# EAGLE schematic DrumidySynth (EAGLE 9.6.2)

## Sheet 1 of 6: F407
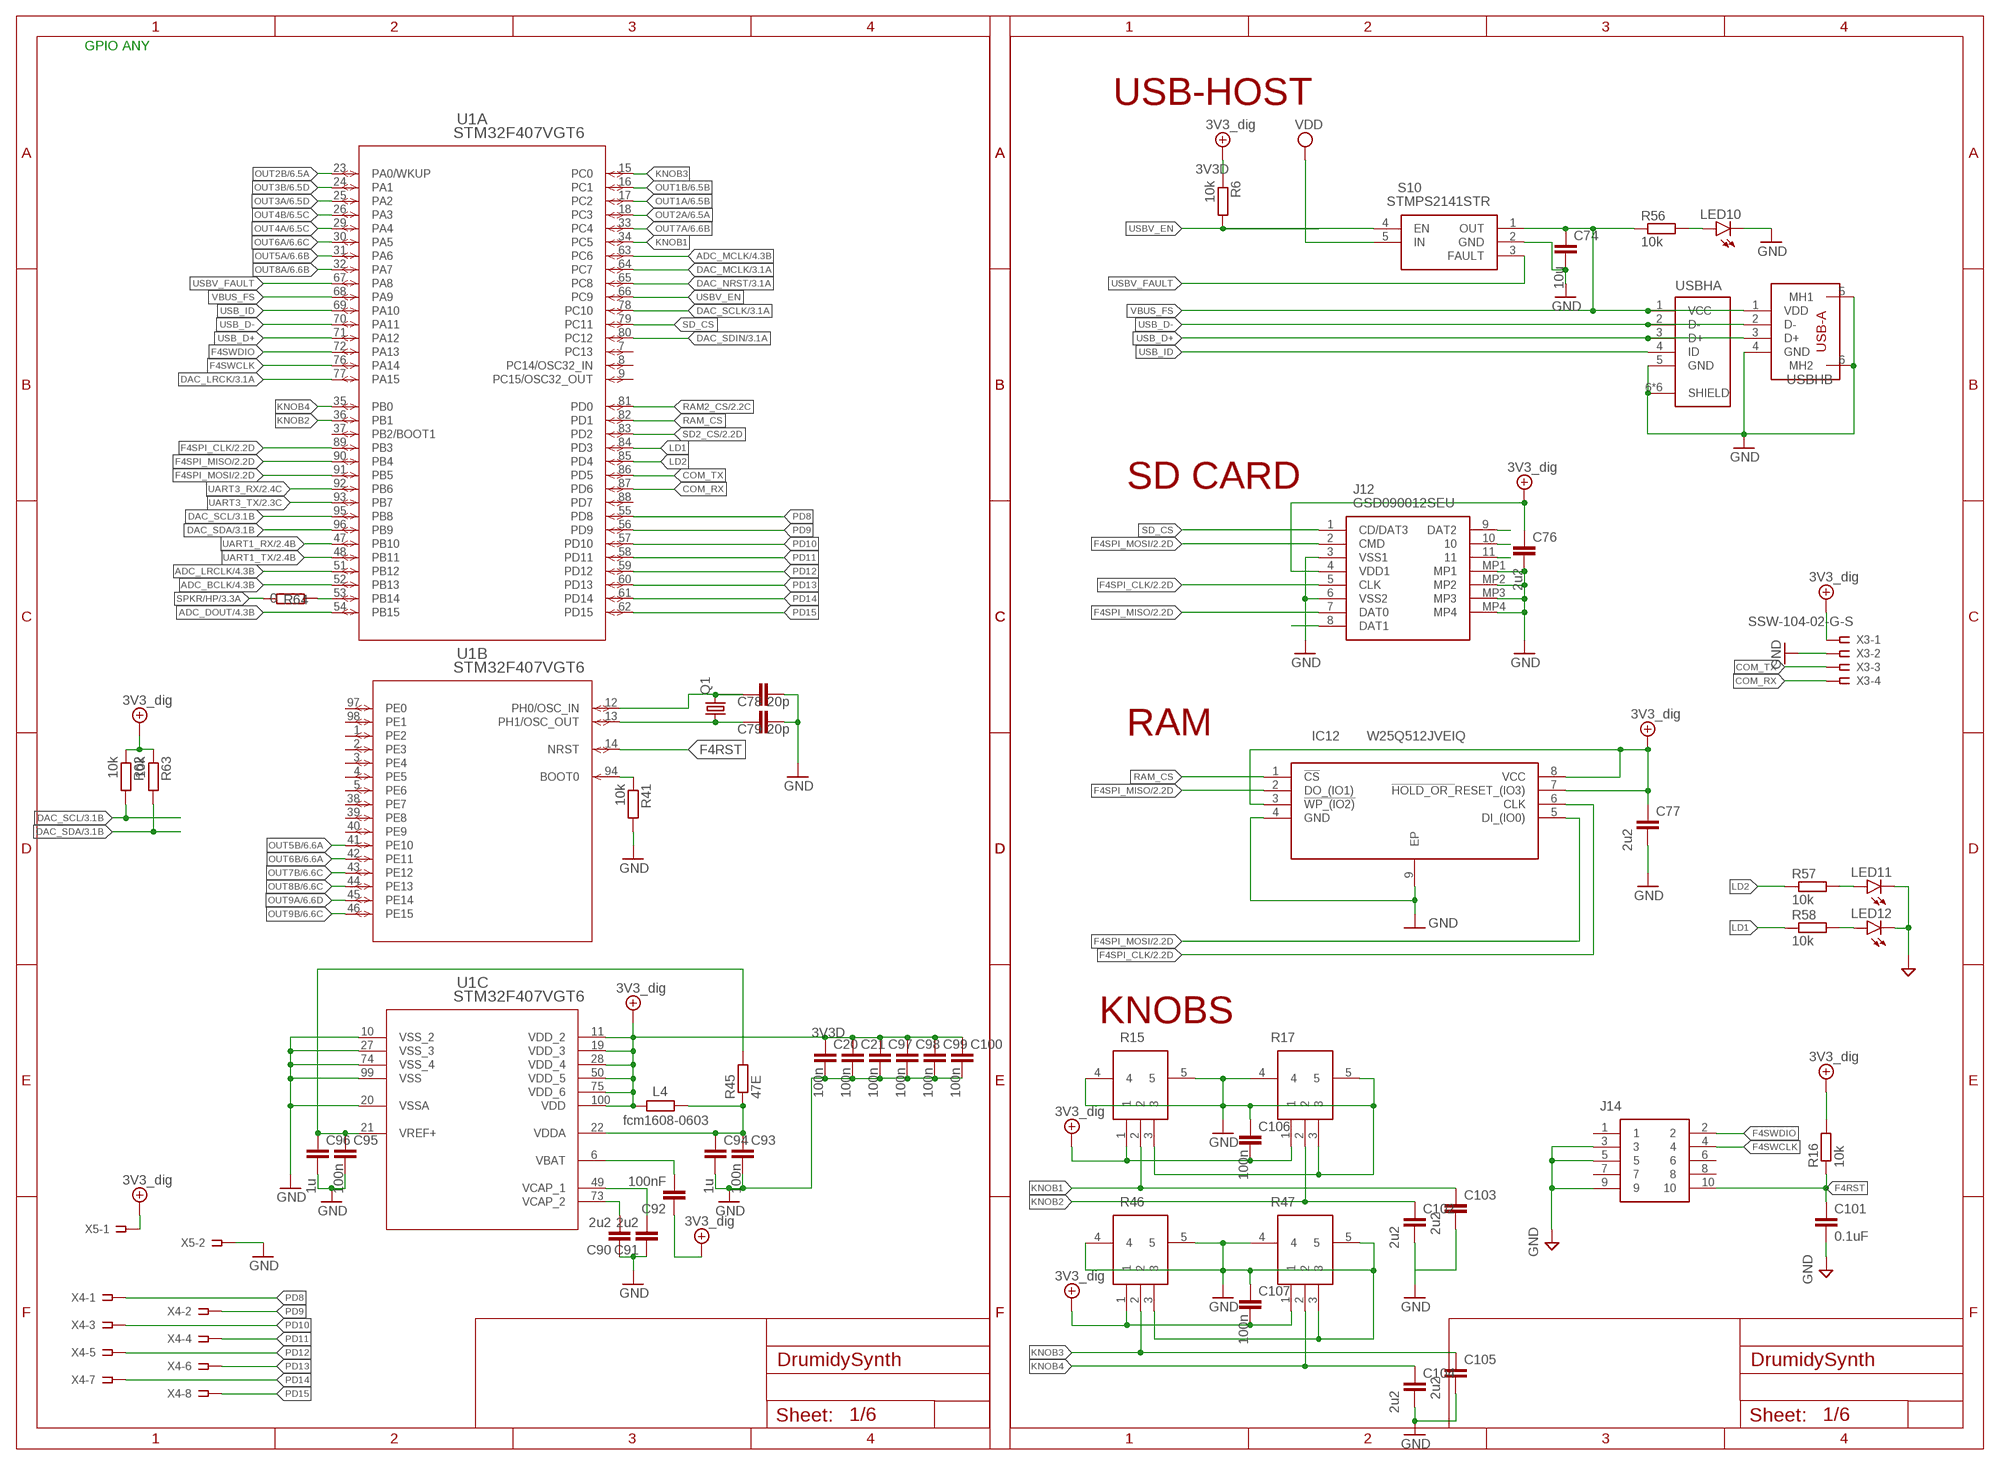
[diagram p0: schematic, sheet 1]

### Parts
C20  100n  C-EUC0603K  [C0603K]
C21  100n  C-EUC0603K  [C0603K]
C74  10u  C-EUC0805K  [C0805K]
C76  2u2  C-EUC0805K  [C0805K]
C77  2u2  C-EUC0805K  [C0805K]
C78  20p  C-EUC0402K  [C0402K]
C79  20p  C-EUC0402K  [C0402K]
C90  2u2  C-EUC0603K  [C0603K]
C91  2u2  C-EUC0603K  [C0603K]
C92  100nF  C-EUC0603K  [C0603K]
C93  100n  C-EUC0603K  [C0603K]
C94  1u  C-EUC0805K  [C0805K]
C95  100n  C-EUC0603K  [C0603K]
C96  1u  C-EUC0805K  [C0805K]
C97  100n  C-EUC0603K  [C0603K]
C98  100n  C-EUC0603K  [C0603K]
C99  100n  C-EUC0603K  [C0603K]
C100  100n  C-EUC0603K  [C0603K]
C101  0.1uF  C-EUC0402  [C0402]
C102  2u2  C-EUC0805K  [C0805K]
C103  2u2  C-EUC0805K  [C0805K]
C104  2u2  C-EUC0805K  [C0805K]
C105  2u2  C-EUC0805K  [C0805K]
C106  100n  C-EUC0603K  [C0603K]
C107  100n  C-EUC0603K  [C0603K]
IC12  W25Q512JVEIQ  [SON127P800X600X80-9N]
J12  GSD090012SEU  [GSD090012SEU]
J14  FTSH-105-01-F-DV-K-A-P-TR  [FTSH-105-XX-YYY-DV-K-A-P-TR]
L4  fcm1608-0603  R-EU_R0603  [R0603]
LED10  LEDCHIP-LED0603  [CHIP-LED0603]
LED11  LEDCHIP-LED0603  [CHIP-LED0603]
LED12  LEDCHIP-LED0603  [CHIP-LED0603]
Q1  CRYSTALHC49S  [HC49/S]
R6  10k  R-EU_R0603  [R0603]
R15  PTV09A-4025U-B103  [PTV09A4020FB103]
R16  10k  R-EU_R0603  [R0603]
R17  PTV09A-4025U-B103  [PTV09A4020FB103]
R41  10k  R-EU_R0603  [R0603]
R45  47E  R-EU_R0603  [R0603]
R46  PTV09A-4025U-B103  [PTV09A4020FB103]
R47  PTV09A-4025U-B103  [PTV09A4020FB103]
R56  10k  R-EU_R0603  [R0603]
R57  10k  R-EU_R0603  [R0603]
R58  10k  R-EU_R0603  [R0603]
R62  10k  R-EU_R0603  [R0603]
R63  10k  R-EU_R0603  [R0603]
R64  0  R-EU_R0603  [R0603]
S10  STMPS2141STR  [SOT95P280X145-5N]
U1  STM32F407VGT6  [LQFP100-14X14MM]
USBHA  10103594-0001LF  [AMPHENOL_10103594-0001LF]
USBHB  USB-A(292303-7)  [2923037]
X3  SSW-104-02-G-S  [SSW-104-02-G-S]
X4  SSW-104-02-G-D  [SSW-104-02-G-D]
X5  SSW-102-02-G-S  [SSW-102-02-G-S]

### Nets
3V3D: C20.1 C21.1 C76.1 C77.1 C92.1 C97.1 C98.1 C99.1 C100.1 C106.2 C107.2 IC12.3(!WP_(IO2)) IC12.7(!HOLD_OR_!RESET_(IO3)) IC12.8(VCC) J12.4(VDD1) L4.2 R6.1 R15.1 R16.2 R17.1 R46.1 R47.1 R62.1 R63.1 U1.11(C:VDD_2) U1.19(C:VDD_3) U1.28(C:VDD_4) U1.50(C:VDD_5) U1.75(C:VDD_6) U1.100(C:VDD) X3.1 X5.1 ; supply symbol labelled 3V3_dig ; also sheet 2,3,4,5,6
ADC_BCLK: U1.52(A:PB13) ; also sheet 4
ADC_DOUT: U1.54(A:PB15) ; also sheet 4
ADC_LRCLK: U1.51(A:PB12) ; also sheet 4
ADC_MCLK: U1.63(A:PC6) ; also sheet 4
COM_RX: U1.87(A:PD6) X3.4
COM_TX: U1.86(A:PD5) X3.3
DAC_LRCK: U1.77(A:PA15) ; also sheet 3
DAC_MCLK: U1.64(A:PC7) ; also sheet 3
DAC_NRST: U1.65(A:PC8) ; also sheet 3
DAC_SCL: R62.2 U1.95(A:PB8) ; also sheet 3
DAC_SCLK: U1.78(A:PC10) ; also sheet 3
DAC_SDA: R63.2 U1.96(A:PB9) ; also sheet 3
DAC_SDIN: U1.80(A:PC12) ; also sheet 3
F4RST: C101.1 J14.10 R16.1 U1.14(B:NRST)
F4SPI_CLK: IC12.6(CLK) J12.5(CLK) U1.89(A:PB3) ; also sheet 2
F4SPI_MISO: IC12.2(DO_(IO1)) J12.7(DAT0) U1.90(A:PB4) ; also sheet 2
F4SPI_MOSI: IC12.5(DI_(IO0)) J12.2(CMD) U1.91(A:PB5) ; also sheet 2
F4SWCLK: J14.4 U1.76(A:PA14)
F4SWDIO: J14.2 U1.72(A:PA13)
GND: C20.2 C21.2 C74.2 C76.2 C77.2 C78.2 C79.2 C90.1 C91.1 C93.2 C94.2 C95.2 C96.2 C97.2 C98.2 C99.2 C100.2 C101.2 C102.2 C103.2 C104.2 C105.2 C106.1 C107.1 IC12.4(GND) IC12.9(EP) J12.3(VSS1) J12.6(VSS2) J12.MP1 J12.MP2 J12.MP3 J12.MP4 J14.3 J14.5 J14.9 LED10.C LED11.C LED12.C R15.3 R15.4 R15.5 R17.3 R17.4 R17.5 R41.2 R46.3 R46.4 R46.5 R47.3 R47.4 R47.5 S10.2(GND) U1.10(C:VSS_2) U1.20(C:VSSA) U1.27(C:VSS_3) U1.74(C:VSS_4) U1.99(C:VSS) USBHA.5(GND) USBHA.6(SHIELD) USBHA.7(SHIELD) USBHA.8(SHIELD) USBHA.9(SHIELD) USBHA.S1(SHIELD) USBHA.S2(SHIELD) USBHB.4(GND) USBHB.5(MH1) USBHB.6(MH2) X3.2 X5.2 ; also sheet 2,3,4,5,6
KNOB1: C103.1 R15.2 U1.34(A:PC5)
KNOB2: C102.1 R17.2 U1.36(A:PB1)
KNOB3: C105.1 R46.2 U1.15(A:PC0)
KNOB4: C104.1 R47.2 U1.35(A:PB0)
LD1: R58.1 U1.84(A:PD3)
LD2: R57.1 U1.85(A:PD4)
N$16: R64.2 U1.53(A:PB14)
N$21: C78.1 Q1.2 U1.12(B:PH0/OSC_IN)
N$22: C79.1 Q1.1 U1.13(B:PH1/OSC_OUT)
N$87: R41.1 U1.94(B:BOOT0)
N$90: LED10.A R56.2
N$91: LED11.A R57.2
N$92: LED12.A R58.2
N$93: C90.2 U1.73(C:VCAP_2)
N$94: C91.2 U1.49(C:VCAP_1)
N$95: C92.2 U1.6(C:VBAT)
N$96: C93.1 C94.1 L4.1 R45.1 U1.22(C:VDDA)
N$97: C95.1 C96.1 R45.2 U1.21(C:VREF+)
N$99: J12.8(DAT1)
N$104: J12.9(DAT2)
N$107: J12.10
N$109: J12.11
OUT1A: U1.17(A:PC2) ; also sheet 6
OUT1B: U1.16(A:PC1) ; also sheet 6
OUT2A: U1.18(A:PC3) ; also sheet 6
OUT2B: U1.23(A:PA0/WKUP) ; also sheet 6
OUT3A: U1.25(A:PA2) ; also sheet 6
OUT3B: U1.24(A:PA1) ; also sheet 6
OUT4A: U1.29(A:PA4) ; also sheet 6
OUT4B: U1.26(A:PA3) ; also sheet 6
OUT5A: U1.31(A:PA6) ; also sheet 6
OUT5B: U1.41(B:PE10) ; also sheet 6
OUT6A: U1.30(A:PA5) ; also sheet 6
OUT6B: U1.42(B:PE11) ; also sheet 6
OUT7A: U1.33(A:PC4) ; also sheet 6
OUT7B: U1.43(B:PE12) ; also sheet 6
OUT8A: U1.32(A:PA7) ; also sheet 6
OUT8B: U1.44(B:PE13) ; also sheet 6
OUT9A: U1.45(B:PE14) ; also sheet 6
OUT9B: U1.46(B:PE15) ; also sheet 6
PD8: U1.55(A:PD8) X4.1
PD9: U1.56(A:PD9) X4.2
PD10: U1.57(A:PD10) X4.3
PD11: U1.58(A:PD11) X4.4
PD12: U1.59(A:PD12) X4.5
PD13: U1.60(A:PD13) X4.6
PD14: U1.61(A:PD14) X4.7
PD15: U1.62(A:PD15) X4.8
RAM2_CS: U1.81(A:PD0) ; also sheet 2
RAM_CS: IC12.1(!CS) U1.82(A:PD1)
SD2_CS: U1.83(A:PD2) ; also sheet 2
SD_CS: J12.1(CD/DAT3) U1.79(A:PC11)
SPKR/HP: R64.1 ; also sheet 3
UART1_RX: U1.47(A:PB10) ; also sheet 2
UART1_TX: U1.48(A:PB11) ; also sheet 2
UART3_RX: U1.92(A:PB6) ; also sheet 2
UART3_TX: U1.93(A:PB7) ; also sheet 2
USB_D+: U1.71(A:PA12) USBHA.3(D+) USBHB.3(D+)
USB_D-: U1.70(A:PA11) USBHA.2(D-) USBHB.2(D-)
USB_ID: U1.69(A:PA10) USBHA.4(ID)
USBV_EN: R6.2 S10.4(EN) U1.66(A:PC9)
USBV_FAULT: S10.3(FAULT) U1.67(A:PA8)
VBUS_FS: C74.1 R56.1 S10.1(OUT) U1.68(A:PA9) USBHA.1(VCC) USBHB.1(VDD)
VIN: S10.5(IN) ; supply symbol labelled VDD ; also sheet 2,5
Unconnected: J14.1 J14.6 J14.7 J14.8 U1.1(B:PE2) U1.2(B:PE3) U1.3(B:PE4) U1.4(B:PE5) U1.5(B:PE6) U1.7(A:PC13) U1.8(A:PC14/OSC32_IN) U1.9(A:PC15/OSC32_OUT) U1.37(A:PB2/BOOT1) U1.38(B:PE7) U1.39(B:PE8) U1.40(B:PE9) U1.88(A:PD7) U1.97(B:PE0) U1.98(B:PE1)

### Notes on the sheet
- GPIO ANY
- USB-HOST
- SD CARD
- RAM
- KNOBS

## Sheet 2 of 6: F103, controll and display
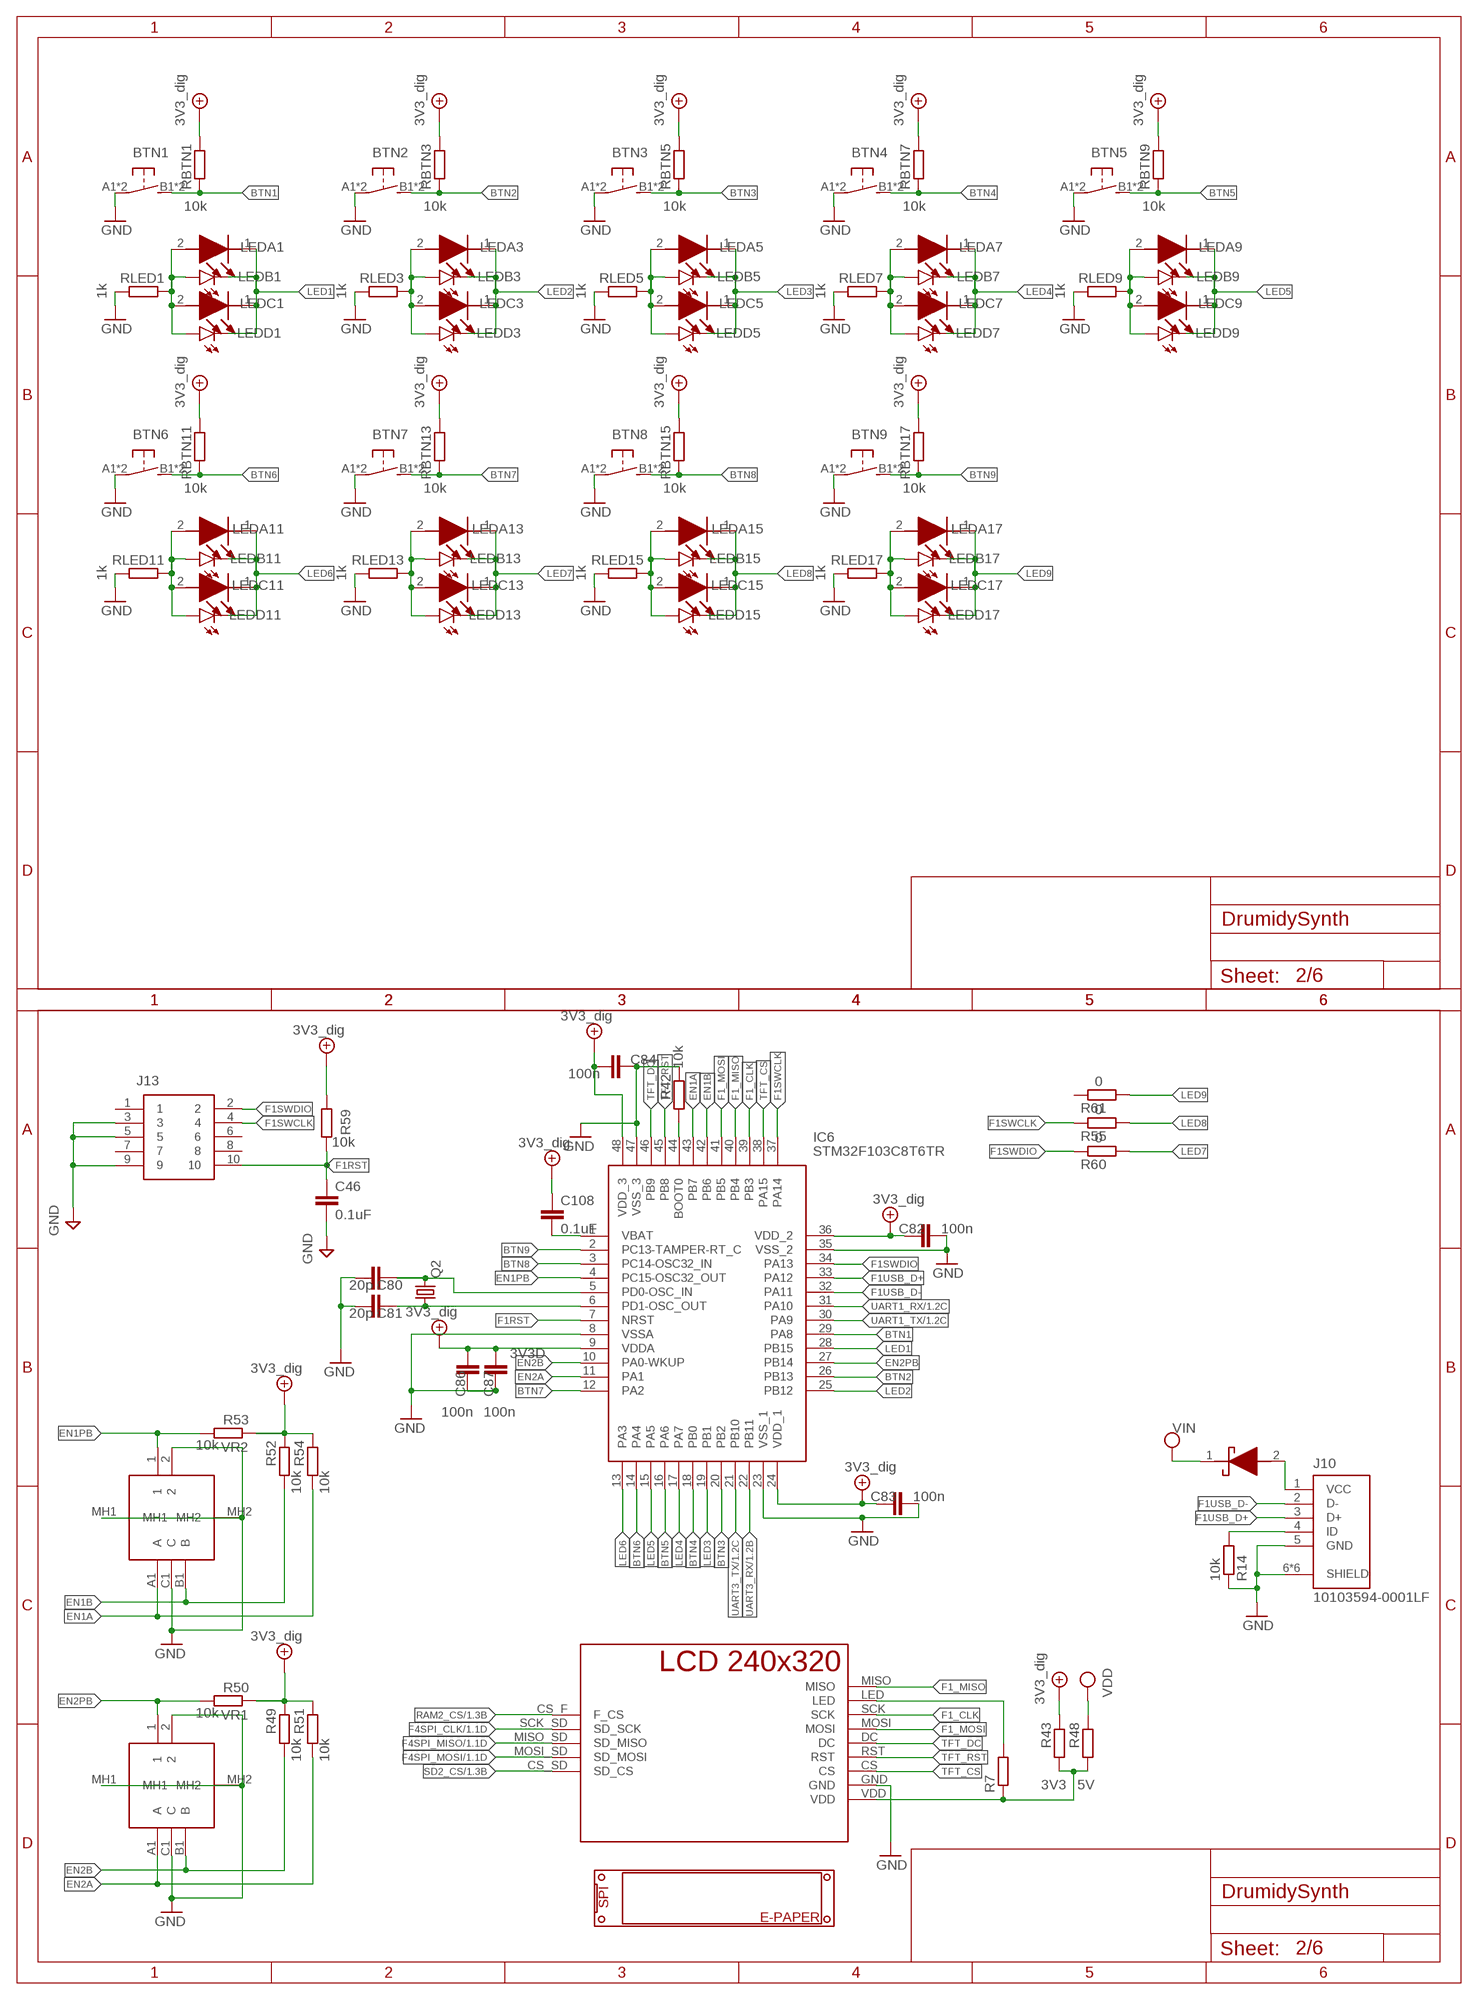
[diagram p1: schematic, sheet 2]

### Parts
BTN1  31-XX  [B3F-31XX]
BTN2  31-XX  [B3F-31XX]
BTN3  31-XX  [B3F-31XX]
BTN4  31-XX  [B3F-31XX]
BTN5  31-XX  [B3F-31XX]
BTN6  31-XX  [B3F-31XX]
BTN7  31-XX  [B3F-31XX]
BTN8  31-XX  [B3F-31XX]
BTN9  31-XX  [B3F-31XX]
C46  0.1uF  C-EUC0402  [C0402]
C80  20p  C-EUC0402K  [C0402K]
C81  20p  C-EUC0402K  [C0402K]
C82  100n  C-EUC0603K  [C0603K]
C83  100n  C-EUC0603K  [C0603K]
C84  100n  C-EUC0603K  [C0603K]
C86  100n  C-EUC0603K  [C0603K]
C87  100n  C-EUC0603K  [C0603K]
C108  0.1uF  C-EUC0402  [C0402]
D1R1  BAT54J,115  [SODFL2512X80N]
IC6  STM32F103C8T6TR  [QFP50P900X900X160-48N]
J10  10103594-0001LF  [AMPHENOL_10103594-0001LF]
J13  FTSH-105-01-F-DV-K-A-P-TR  [FTSH-105-XX-YYY-DV-K-A-P-TR]
LEDA1  L-934HD  [T-1(3MM)_2]
LEDA3  L-934HD  [T-1(3MM)_2]
LEDA5  L-934HD  [T-1(3MM)_2]
LEDA7  L-934HD  [T-1(3MM)_2]
LEDA9  L-934HD  [T-1(3MM)_2]
LEDA11  L-934HD  [T-1(3MM)_2]
LEDA13  L-934HD  [T-1(3MM)_2]
LEDA15  L-934HD  [T-1(3MM)_2]
LEDA17  L-934HD  [T-1(3MM)_2]
LEDB1  LEDCHIP-LED0603  [CHIP-LED0603]
LEDB3  LEDCHIP-LED0603  [CHIP-LED0603]
LEDB5  LEDCHIP-LED0603  [CHIP-LED0603]
LEDB7  LEDCHIP-LED0603  [CHIP-LED0603]
LEDB9  LEDCHIP-LED0603  [CHIP-LED0603]
LEDB11  LEDCHIP-LED0603  [CHIP-LED0603]
LEDB13  LEDCHIP-LED0603  [CHIP-LED0603]
LEDB15  LEDCHIP-LED0603  [CHIP-LED0603]
LEDB17  LEDCHIP-LED0603  [CHIP-LED0603]
LEDC1  L-934HD  [T-1(3MM)_2]
LEDC3  L-934HD  [T-1(3MM)_2]
LEDC5  L-934HD  [T-1(3MM)_2]
LEDC7  L-934HD  [T-1(3MM)_2]
LEDC9  L-934HD  [T-1(3MM)_2]
LEDC11  L-934HD  [T-1(3MM)_2]
LEDC13  L-934HD  [T-1(3MM)_2]
LEDC15  L-934HD  [T-1(3MM)_2]
LEDC17  L-934HD  [T-1(3MM)_2]
LEDD1  LEDCHIP-LED0603  [CHIP-LED0603]
LEDD3  LEDCHIP-LED0603  [CHIP-LED0603]
LEDD5  LEDCHIP-LED0603  [CHIP-LED0603]
LEDD7  LEDCHIP-LED0603  [CHIP-LED0603]
LEDD9  LEDCHIP-LED0603  [CHIP-LED0603]
LEDD11  LEDCHIP-LED0603  [CHIP-LED0603]
LEDD13  LEDCHIP-LED0603  [CHIP-LED0603]
LEDD15  LEDCHIP-LED0603  [CHIP-LED0603]
LEDD17  LEDCHIP-LED0603  [CHIP-LED0603]
Q2  CRYSTALHC49S  [HC49/S]
R7  R-EU_R0805  [R0805]
R14  10k  R-EU_R0603  [R0603]
R42  10k  R-EU_R0603  [R0603]
R43  3V3  R-EU_R0603  [R0603]
R48  5V  R-EU_R0603  [R0603]
R49  10k  R-EU_R0603  [R0603]
R50  10k  R-EU_R0603  [R0603]
R51  10k  R-EU_R0603  [R0603]
R52  10k  R-EU_R0603  [R0603]
R53  10k  R-EU_R0603  [R0603]
R54  10k  R-EU_R0603  [R0603]
R55  0  R-EU_R0603  [R0603]
R59  10k  R-EU_R0603  [R0603]
R60  0  R-EU_R0603  [R0603]
R61  0  R-EU_R0603  [R0603]
RBTN1  10k  R-EU_R0603  [R0603]
RBTN3  10k  R-EU_R0603  [R0603]
RBTN5  10k  R-EU_R0603  [R0603]
RBTN7  10k  R-EU_R0603  [R0603]
RBTN9  10k  R-EU_R0603  [R0603]
RBTN11  10k  R-EU_R0603  [R0603]
RBTN13  10k  R-EU_R0603  [R0603]
RBTN15  10k  R-EU_R0603  [R0603]
RBTN17  10k  R-EU_R0603  [R0603]
RLED1  1k  R-EU_R0603  [R0603]
RLED3  1k  R-EU_R0603  [R0603]
RLED5  1k  R-EU_R0603  [R0603]
RLED7  1k  R-EU_R0603  [R0603]
RLED9  1k  R-EU_R0603  [R0603]
RLED11  1k  R-EU_R0603  [R0603]
RLED13  1k  R-EU_R0603  [R0603]
RLED15  1k  R-EU_R0603  [R0603]
RLED17  1k  R-EU_R0603  [R0603]
U$2  TFT-SD  [TFTQVGA]
U$3  EPAPER2.9  [EPAPERLCDNOPIN]
VR1  PEC11R-4220F-S0024  [PEC11R4220FS0024]
VR2  PEC11R-4220F-S0024  [PEC11R4220FS0024]

### Nets
3V3D: C82.1 C83.1 C84.2 C86.2 C87.2 C108.1 IC6.9(VDDA) IC6.24(VDD_1) IC6.36(VDD_2) IC6.48(VDD_3) R43.1 R49.1 R50.1 R51.1 R52.1 R53.1 R54.1 R59.2 RBTN1.1 RBTN3.1 RBTN5.1 RBTN7.1 RBTN9.1 RBTN11.1 RBTN13.1 RBTN15.1 RBTN17.1 ; supply symbol labelled 3V3_dig ; also sheet 1,3,4,5,6
BTN1: BTN1.B1(S) BTN1.B2(S) IC6.29(PA8) RBTN1.2
BTN2: BTN2.B1(S) BTN2.B2(S) IC6.26(PB13) RBTN3.2
BTN3: BTN3.B1(S) BTN3.B2(S) IC6.20(PB2) RBTN5.2
BTN4: BTN4.B1(S) BTN4.B2(S) IC6.18(PB0) RBTN7.2
BTN5: BTN5.B1(S) BTN5.B2(S) IC6.16(PA6) RBTN9.2
BTN6: BTN6.B1(S) BTN6.B2(S) IC6.14(PA4) RBTN11.2
BTN7: BTN7.B1(S) BTN7.B2(S) IC6.12(PA2) RBTN13.2
BTN8: BTN8.B1(S) BTN8.B2(S) IC6.3(PC14-OSC32_IN) RBTN15.2
BTN9: BTN9.B1(S) BTN9.B2(S) IC6.2(PC13-TAMPER-RT_C) RBTN17.2
EN1A: IC6.43(PB7) R54.2 VR2.A1(A)
EN1B: IC6.42(PB6) R52.2 VR2.B1(B)
EN1PB: IC6.4(PC15-OSC32_OUT) R53.2 VR2.1
EN2A: IC6.11(PA1) R51.2 VR1.A1(A)
EN2B: IC6.10(PA0-WKUP) R49.2 VR1.B1(B)
EN2PB: IC6.27(PB14) R50.2 VR1.1
F1_CLK: IC6.39(PB3) U$2.SCK
F1_MISO: IC6.40(PB4) U$2.MISO
F1_MOSI: IC6.41(PB5) U$2.MOSI
F1RST: C46.1 IC6.7(NRST) J13.10 R59.1
F1SWCLK: IC6.37(PA14) J13.4 R55.1
F1SWDIO: IC6.34(PA13) J13.2 R60.1
F1USB_D+: IC6.33(PA12) J10.3(D+)
F1USB_D-: IC6.32(PA11) J10.2(D-)
F4SPI_CLK: U$2.SCK_SD(SD_SCK) ; also sheet 1
F4SPI_MISO: U$2.MISO_SD(SD_MISO) ; also sheet 1
F4SPI_MOSI: U$2.MOSI_SD(SD_MOSI) ; also sheet 1
GND: BTN1.A1(P) BTN1.A2(P) BTN2.A1(P) BTN2.A2(P) BTN3.A1(P) BTN3.A2(P) BTN4.A1(P) BTN4.A2(P) BTN5.A1(P) BTN5.A2(P) BTN6.A1(P) BTN6.A2(P) BTN7.A1(P) BTN7.A2(P) BTN8.A1(P) BTN8.A2(P) BTN9.A1(P) BTN9.A2(P) C46.2 C80.2 C81.2 C82.2 C83.2 C84.1 C86.1 C87.1 IC6.8(VSSA) IC6.23(VSS_1) IC6.35(VSS_2) IC6.47(VSS_3) J10.5(GND) J10.6(SHIELD) J10.7(SHIELD) J10.8(SHIELD) J10.9(SHIELD) J10.S1(SHIELD) J10.S2(SHIELD) J13.3 J13.5 J13.9 R14.1 R42.1 RLED1.2 RLED3.2 RLED5.2 RLED7.2 RLED9.2 RLED11.2 RLED13.2 RLED15.2 RLED17.2 U$2.GND VR1.2 VR1.C1(C) VR1.MH1 VR1.MH2 VR2.2 VR2.C1(C) VR2.MH1 VR2.MH2 ; also sheet 1,3,4,5,6
LED1: IC6.28(PB15) LEDA1.1(K) LEDB1.C LEDC1.1(K) LEDD1.C
LED2: IC6.25(PB12) LEDA3.1(K) LEDB3.C LEDC3.1(K) LEDD3.C
LED3: IC6.19(PB1) LEDA5.1(K) LEDB5.C LEDC5.1(K) LEDD5.C
LED4: IC6.17(PA7) LEDA7.1(K) LEDB7.C LEDC7.1(K) LEDD7.C
LED5: IC6.15(PA5) LEDA9.1(K) LEDB9.C LEDC9.1(K) LEDD9.C
LED6: IC6.13(PA3) LEDA11.1(K) LEDB11.C LEDC11.1(K) LEDD11.C
LED7: LEDA13.1(K) LEDB13.C LEDC13.1(K) LEDD13.C R60.2
LED8: LEDA15.1(K) LEDB15.C LEDC15.1(K) LEDD15.C R55.2
LED9: LEDA17.1(K) LEDB17.C LEDC17.1(K) LEDD17.C R61.2
N$52: C80.1 IC6.5(PD0-OSC_IN) Q2.2
N$59: C81.1 IC6.6(PD1-OSC_OUT) Q2.1
N$88: IC6.44(BOOT0) R42.2
N$98: C108.2 IC6.1(VBAT)
N$100: D1R1.2(A) J10.1(VCC)
N$101: J10.4(ID) R14.2
N$102: R7.2 U$2.LED
N$103: R7.1 R43.2 R48.2 U$2.VDD
N$105: LEDA1.2(A) LEDB1.A LEDC1.2(A) LEDD1.A RLED1.1
N$106: LEDA3.2(A) LEDB3.A LEDC3.2(A) LEDD3.A RLED3.1
N$108: LEDA5.2(A) LEDB5.A LEDC5.2(A) LEDD5.A RLED5.1
N$110: LEDA7.2(A) LEDB7.A LEDC7.2(A) LEDD7.A RLED7.1
N$112: LEDA9.2(A) LEDB9.A LEDC9.2(A) LEDD9.A RLED9.1
N$114: LEDA11.2(A) LEDB11.A LEDC11.2(A) LEDD11.A RLED11.1
N$116: LEDA13.2(A) LEDB13.A LEDC13.2(A) LEDD13.A RLED13.1
N$118: LEDA15.2(A) LEDB15.A LEDC15.2(A) LEDD15.A RLED15.1
N$120: LEDA17.2(A) LEDB17.A LEDC17.2(A) LEDD17.A RLED17.1
RAM2_CS: U$2.CS_F(F_CS) ; also sheet 1
SD2_CS: U$2.CS_SD(SD_CS) ; also sheet 1
TFT_CS: IC6.38(PA15) U$2.CS
TFT_DC: IC6.46(PB9) U$2.DC
TFT_RST: IC6.45(PB8) U$2.RST
UART1_RX: IC6.31(PA10) ; also sheet 1
UART1_TX: IC6.30(PA9) ; also sheet 1
UART3_RX: IC6.22(PB11) ; also sheet 1
UART3_TX: IC6.21(PB10) ; also sheet 1
VIN: D1R1.1(K) R48.1 ; supply symbol labelled VDD ; also sheet 1,5
Unconnected: J13.1 J13.6 J13.7 J13.8 R61.1

## Sheet 3 of 6: DAC and line-in/-out connection
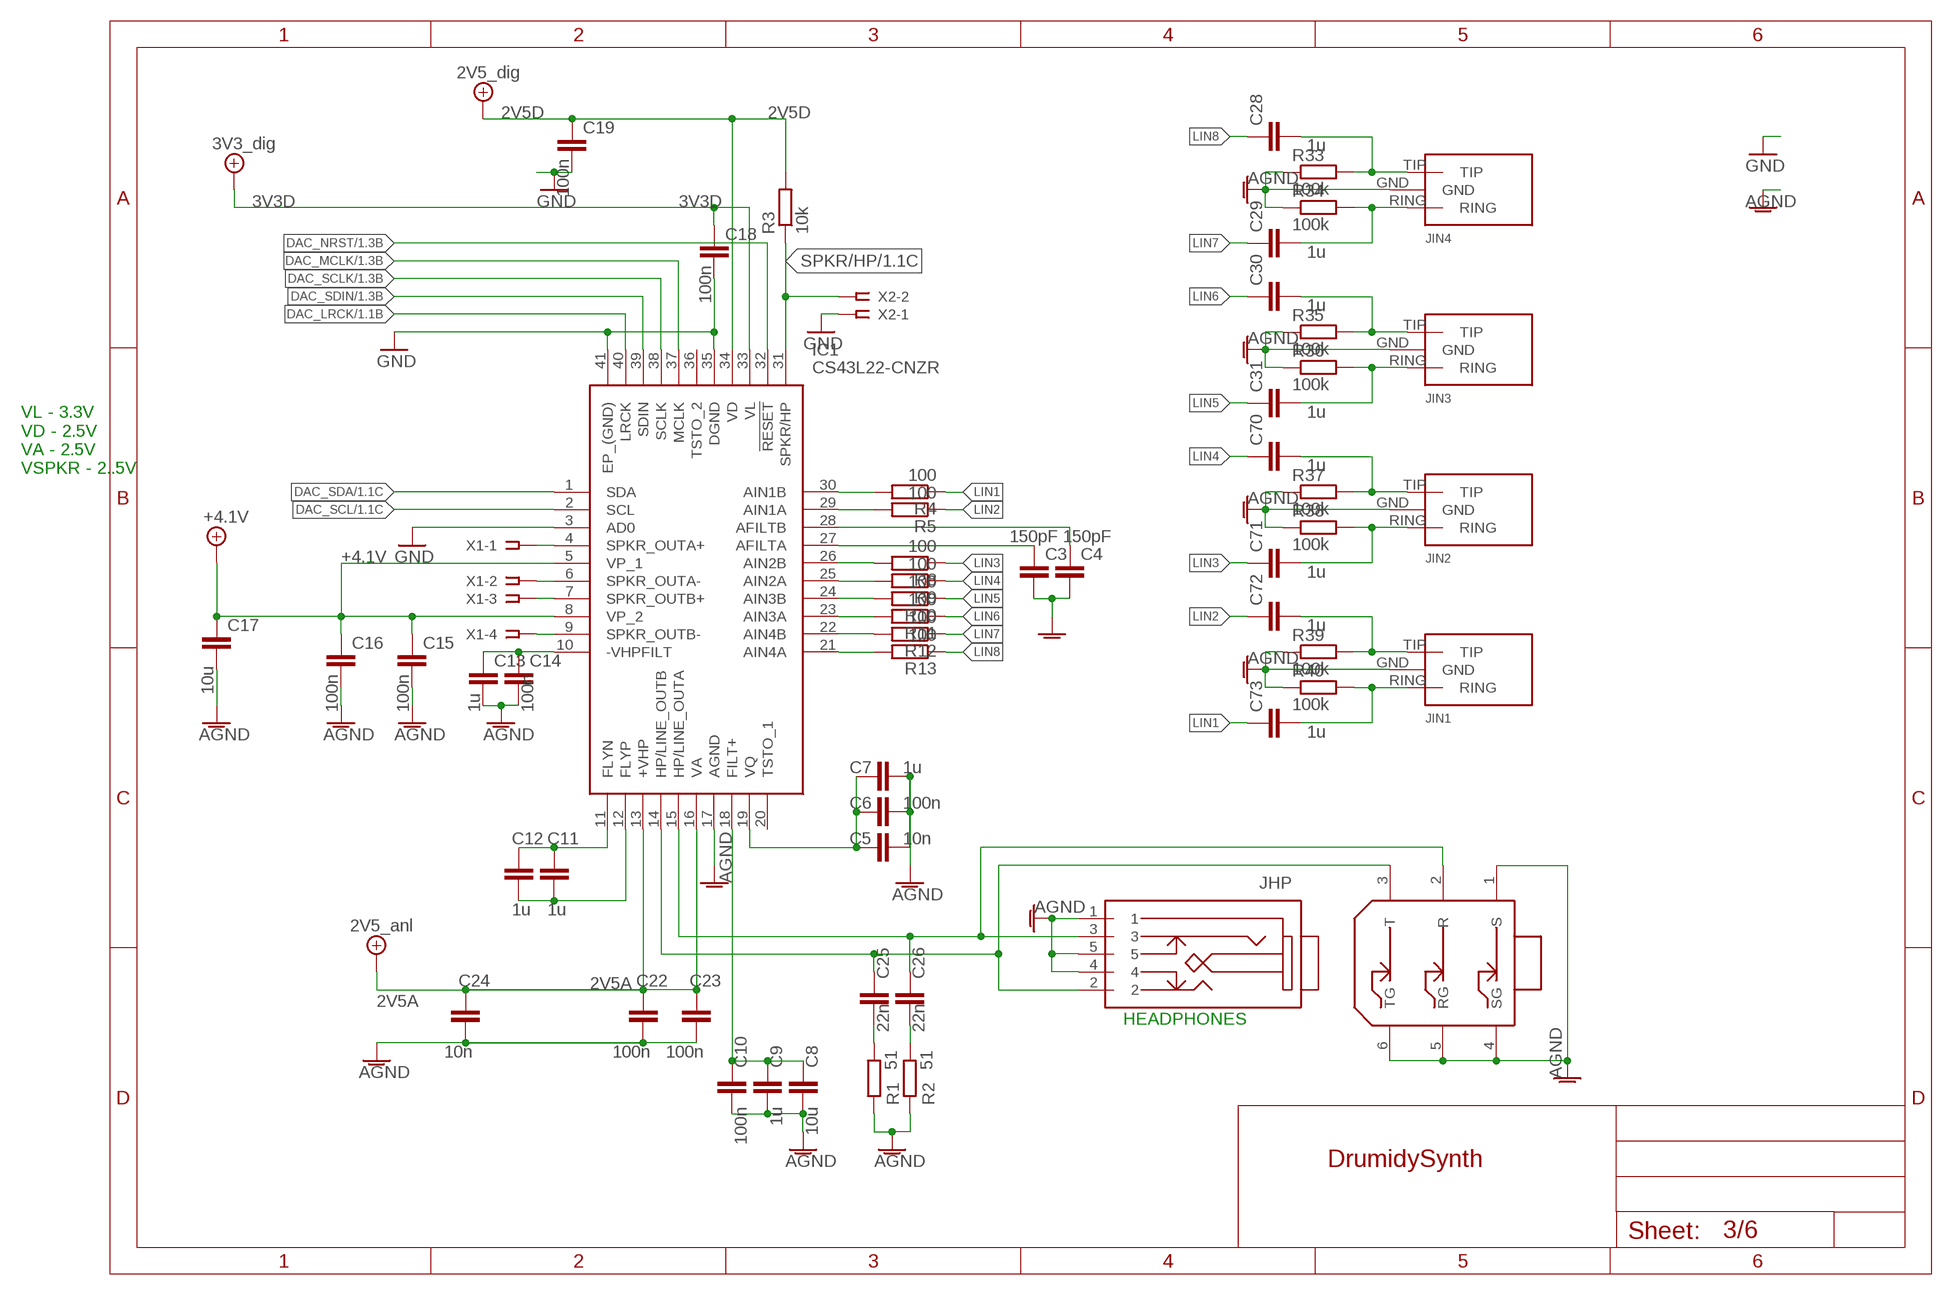
[diagram p2: schematic, sheet 3]

### Parts
C3  150pF  C-EUC0402K  [C0402K]
C4  150pF  C-EUC0402K  [C0402K]
C5  10n  C-EUC0402K  [C0402K]
C6  100n  C-EUC0603K  [C0603K]
C7  1u  C-EUC0603K  [C0603K]
C8  10u  C-EUC0805K  [C0805K]
C9  1u  C-EUC0603K  [C0603K]
C10  100n  C-EUC0603K  [C0603K]
C11  1u  C-EUC0603K  [C0603K]
C12  1u  C-EUC0603K  [C0603K]
C13  1u  C-EUC0603K  [C0603K]
C14  100n  C-EUC0603K  [C0603K]
C15  100n  C-EUC0603K  [C0603K]
C16  100n  C-EUC0603K  [C0603K]
C17  10u  C-EUC0805K  [C0805K]
C18  100n  C-EUC0603K  [C0603K]
C19  100n  C-EUC0603K  [C0603K]
C22  100n  C-EUC0603K  [C0603K]
C23  100n  C-EUC0603K  [C0603K]
C24  10n  C-EUC0402K  [C0402K]
C25  22n  C-EUC0603K  [C0603K]
C26  22n  C-EUC0603K  [C0603K]
C28  1u  C-EUC0603K  [C0603K]
C29  1u  C-EUC0603K  [C0603K]
C30  1u  C-EUC0603K  [C0603K]
C31  1u  C-EUC0603K  [C0603K]
C70  1u  C-EUC0603K  [C0603K]
C71  1u  C-EUC0603K  [C0603K]
C72  1u  C-EUC0603K  [C0603K]
C73  1u  C-EUC0603K  [C0603K]
IC1  CS43L22-CNZR  [QFN50P600X600X100-41N]
JHP  35RAPC2AVN4  [35RAPC2AVN4]
JIN1  JACK35VERT  [JACK35VERT]
JIN2  JACK35VERT  [JACK35VERT]
JIN3  JACK35VERT  [JACK35VERT]
JIN4  JACK35VERT  [JACK35VERT]
JOUT  SJ-63073E  [SJ63073E]
R1  51  R-EU_R0603  [R0603]
R2  51  R-EU_R0603  [R0603]
R3  10k  R-EU_R0603  [R0603]
R4  100  R-EU_R0603  [R0603]
R5  100  R-EU_R0603  [R0603]
R8  100  R-EU_R0603  [R0603]
R9  100  R-EU_R0603  [R0603]
R10  100  R-EU_R0603  [R0603]
R11  100  R-EU_R0603  [R0603]
R12  100  R-EU_R0603  [R0603]
R13  100  R-EU_R0603  [R0603]
R33  100k  R-EU_R0603  [R0603]
R34  100k  R-EU_R0603  [R0603]
R35  100k  R-EU_R0603  [R0603]
R36  100k  R-EU_R0603  [R0603]
R37  100k  R-EU_R0603  [R0603]
R38  100k  R-EU_R0603  [R0603]
R39  100k  R-EU_R0603  [R0603]
R40  100k  R-EU_R0603  [R0603]
X1  SSW-104-02-G-S  [SSW-104-02-G-S]
X2  SSW-102-02-G-S  [SSW-102-02-G-S]

### Nets
2V5A: C22.1 C23.1 C24.1 IC1.13(+VHP) IC1.16(VA) ; supply symbol labelled 2V5_anl ; also sheet 5
2V5D: C19.1 IC1.34(VD) R3.2 ; supply symbol labelled 2V5_dig ; also sheet 5
3V3D: C18.1 IC1.33(VL) ; supply symbol labelled 3V3_dig ; also sheet 1,2,4,5,6
+4.1V: C15.1 C16.1 C17.1 IC1.5(VP_1) IC1.8(VP_2) ; also sheet 5
DAC_LRCK: IC1.40(LRCK) ; also sheet 1
DAC_MCLK: IC1.37(MCLK) ; also sheet 1
DAC_NRST: IC1.32(!RESET) ; also sheet 1
DAC_SCL: IC1.2(SCL) ; also sheet 1
DAC_SCLK: IC1.38(SCLK) ; also sheet 1
DAC_SDA: IC1.1(SDA) ; also sheet 1
DAC_SDIN: IC1.39(SDIN) ; also sheet 1
GND: C3.2 C4.2 C5.2 C6.2 C7.2 C8.2 C9.2 C10.2 C13.2 C14.2 C15.2 C16.2 C17.2 C18.2 C19.2 C22.2 C23.2 C24.2 IC1.3(AD0) IC1.17(AGND) IC1.35(DGND) IC1.41(EP_(GND)) JHP.1 JHP.4 JHP.5 JIN1.GND JIN2.GND JIN3.GND JIN4.GND JOUT.1(S) JOUT.4(SG) JOUT.5(RG) JOUT.6(TG) R1.1 R2.1 R33.1 R34.1 R35.1 R36.1 R37.1 R38.1 R39.1 R40.1 X2.1 ; supply symbol labelled AGND ; also sheet 1,2,4,5,6
LIN1: C73.1 R4.1
LIN2: C72.1 R5.1
LIN3: C71.1 R8.1
LIN4: C70.1 R9.1
LIN5: C31.1 R10.1
LIN6: C30.1 R11.1
LIN7: C29.1 R12.1
LIN8: C28.1 R13.1
N$1: C3.1 IC1.27(AFILTA)
N$2: C4.1 IC1.28(AFILTB)
N$3: C5.1 C6.1 C7.1 IC1.19(VQ)
N$4: C8.1 C9.1 C10.1 IC1.18(FILT+)
N$5: C11.1 C12.1 IC1.11(FLYN)
N$6: C11.2 C12.2 IC1.12(FLYP)
N$7: C13.1 C14.1 IC1.10(-VHPFILT)
N$8: IC1.9(SPKR_OUTB-) X1.4
N$9: IC1.7(SPKR_OUTB+) X1.3
N$10: IC1.6(SPKR_OUTA-) X1.2
N$11: IC1.4(SPKR_OUTA+) X1.1
N$12: C25.1 IC1.14(HP/LINE_OUTB) JHP.2 JOUT.3(T)
N$13: C26.1 IC1.15(HP/LINE_OUTA) JHP.3 JOUT.2(R)
N$14: C25.2 R1.2
N$15: C26.2 R2.2
N$17: IC1.30(AIN1B) R4.2
N$18: IC1.29(AIN1A) R5.2
N$23: IC1.26(AIN2B) R8.2
N$24: IC1.25(AIN2A) R9.2
N$25: IC1.24(AIN3B) R10.2
N$26: IC1.23(AIN3A) R11.2
N$27: IC1.22(AIN4B) R12.2
N$28: IC1.21(AIN4A) R13.2
N$73: C73.2 JIN1.RING R40.2
N$74: C72.2 JIN1.TIP R39.2
N$75: C71.2 JIN2.RING R38.2
N$76: C70.2 JIN2.TIP R37.2
N$77: C31.2 JIN3.RING R36.2
N$82: C30.2 JIN3.TIP R35.2
N$84: C29.2 JIN4.RING R34.2
N$86: C28.2 JIN4.TIP R33.2
SPKR/HP: IC1.31(SPKR/HP) R3.1 X2.2 ; also sheet 1
Unconnected: IC1.20(TSTO_1) IC1.36(TSTO_2)

### Notes on the sheet
- VL - 3.3V
  VD - 2.5V
  VA - 2.5V
  VSPKR - 2..5V
- HEADPHONES

## Sheet 4 of 6: External ADC
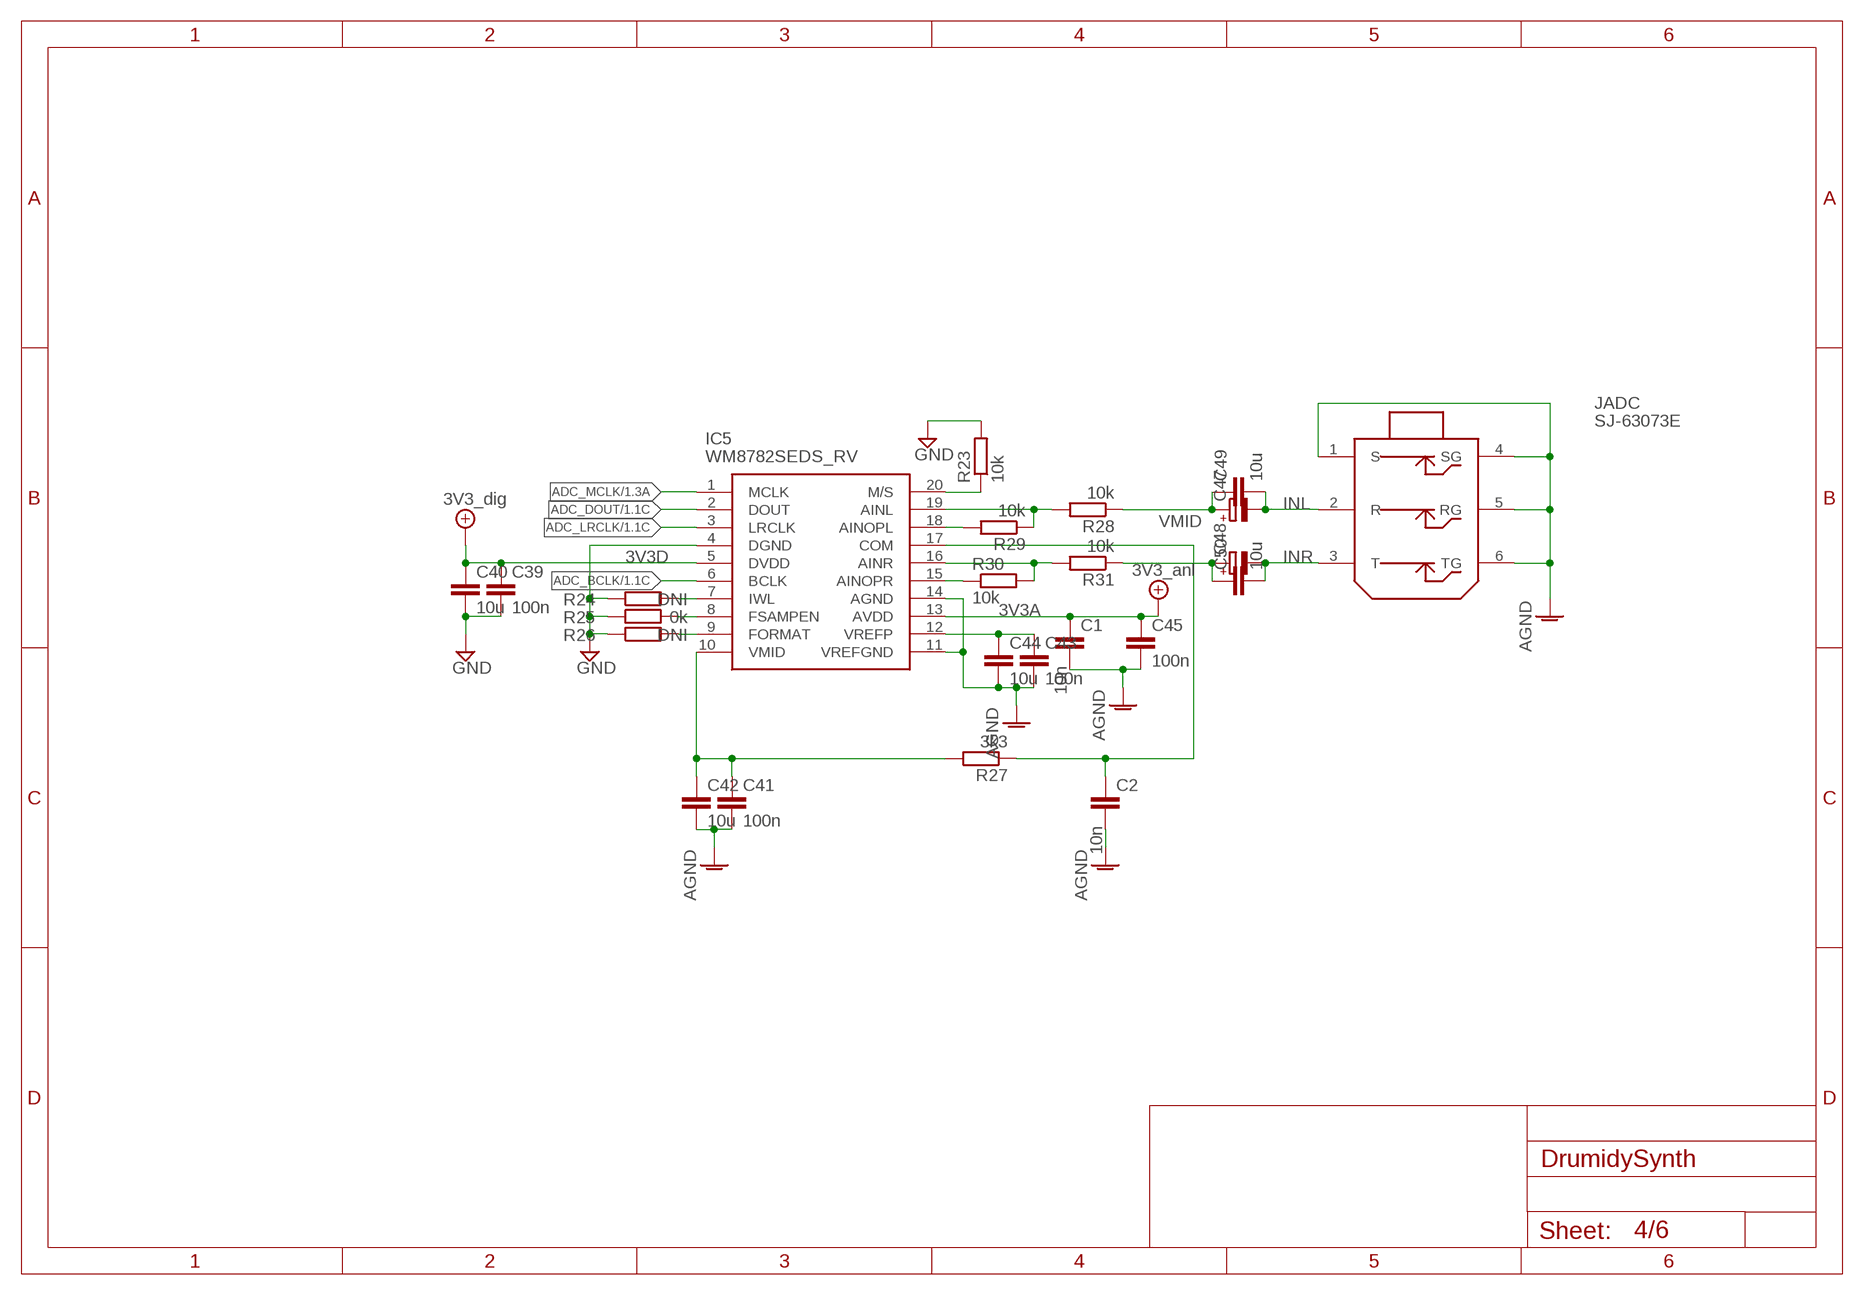
[diagram p3: schematic, sheet 4]

### Parts
C1  10n  C-EUC0402K  [C0402K]
C2  10n  C-EUC0402K  [C0402K]
C39  100n  C-EUC0603K  [C0603K]
C40  10u  C-EUC0603K  [C0603K]
C41  100n  C-EUC0603K  [C0603K]
C42  10u  C-EUC0603K  [C0603K]
C43  100n  C-EUC0603K  [C0603K]
C44  10u  C-EUC0603K  [C0603K]
C45  100n  C-EUC0603K  [C0603K]
C47  CPOL-EUE2-5  [E2-5]
C48  CPOL-EUE2-5  [E2-5]
C49  10u  C-EUC0805  [C0805]
C50  10u  C-EUC0805  [C0805]
IC5  WM8782SEDS_RV  [SOP65P780X200-20N]
JADC  SJ-63073E  [SJ63073E]
R23  10k  R-EU_R0603  [R0603]
R24  DNI  R-EU_R0603  [R0603]
R25  0k  R-EU_R0603  [R0603]
R26  DNI  R-EU_R0603  [R0603]
R27  3k3  R-EU_R0603  [R0603]
R28  10k  R-EU_R0603  [R0603]
R29  10k  R-EU_R0603  [R0603]
R30  10k  R-EU_R0603  [R0603]
R31  10k  R-EU_R0603  [R0603]

### Nets
3V3A: C1.1 C45.1 IC5.13(AVDD) ; supply symbol labelled 3V3_anl ; also sheet 5
3V3D: C39.1 C40.1 IC5.5(DVDD) ; supply symbol labelled 3V3_dig ; also sheet 1,2,3,5,6
ADC_BCLK: IC5.6(BCLK) ; also sheet 1
ADC_DOUT: IC5.2(DOUT) ; also sheet 1
ADC_LRCLK: IC5.3(LRCLK) ; also sheet 1
ADC_MCLK: IC5.1(MCLK) ; also sheet 1
GND: C1.2 C2.2 C39.2 C40.2 C41.2 C42.2 C43.2 C44.2 C45.2 IC5.4(DGND) IC5.11(VREFGND) IC5.14(AGND) JADC.1(S) JADC.4(SG) JADC.5(RG) JADC.6(TG) R23.2 R24.1 R25.1 R26.1 ; supply symbol labelled AGND ; also sheet 1,2,3,5,6
INL: C47.- C49.2 JADC.2(R)
INR: C48.- C50.2 JADC.3(T)
N$39: IC5.20(M/S) R23.1
N$40: IC5.7(IWL) R24.2
N$41: IC5.8(FSAMPEN) R25.2
N$42: IC5.9(FORMAT) R26.2
N$43: C43.1 C44.1 IC5.12(VREFP)
N$44: C2.1 IC5.17(COM) R27.1
N$45: IC5.18(AINOPL) R29.2
N$46: IC5.16(AINR) R30.2 R31.2
N$47: IC5.15(AINOPR) R30.1
N$48: IC5.19(AINL) R28.2 R29.1
N$49: C47.+ C49.1 R28.1
N$50: C48.+ C50.1 R31.1
VMID: C41.1 C42.1 IC5.10(VMID) R27.2

## Sheet 5 of 6: Power supply
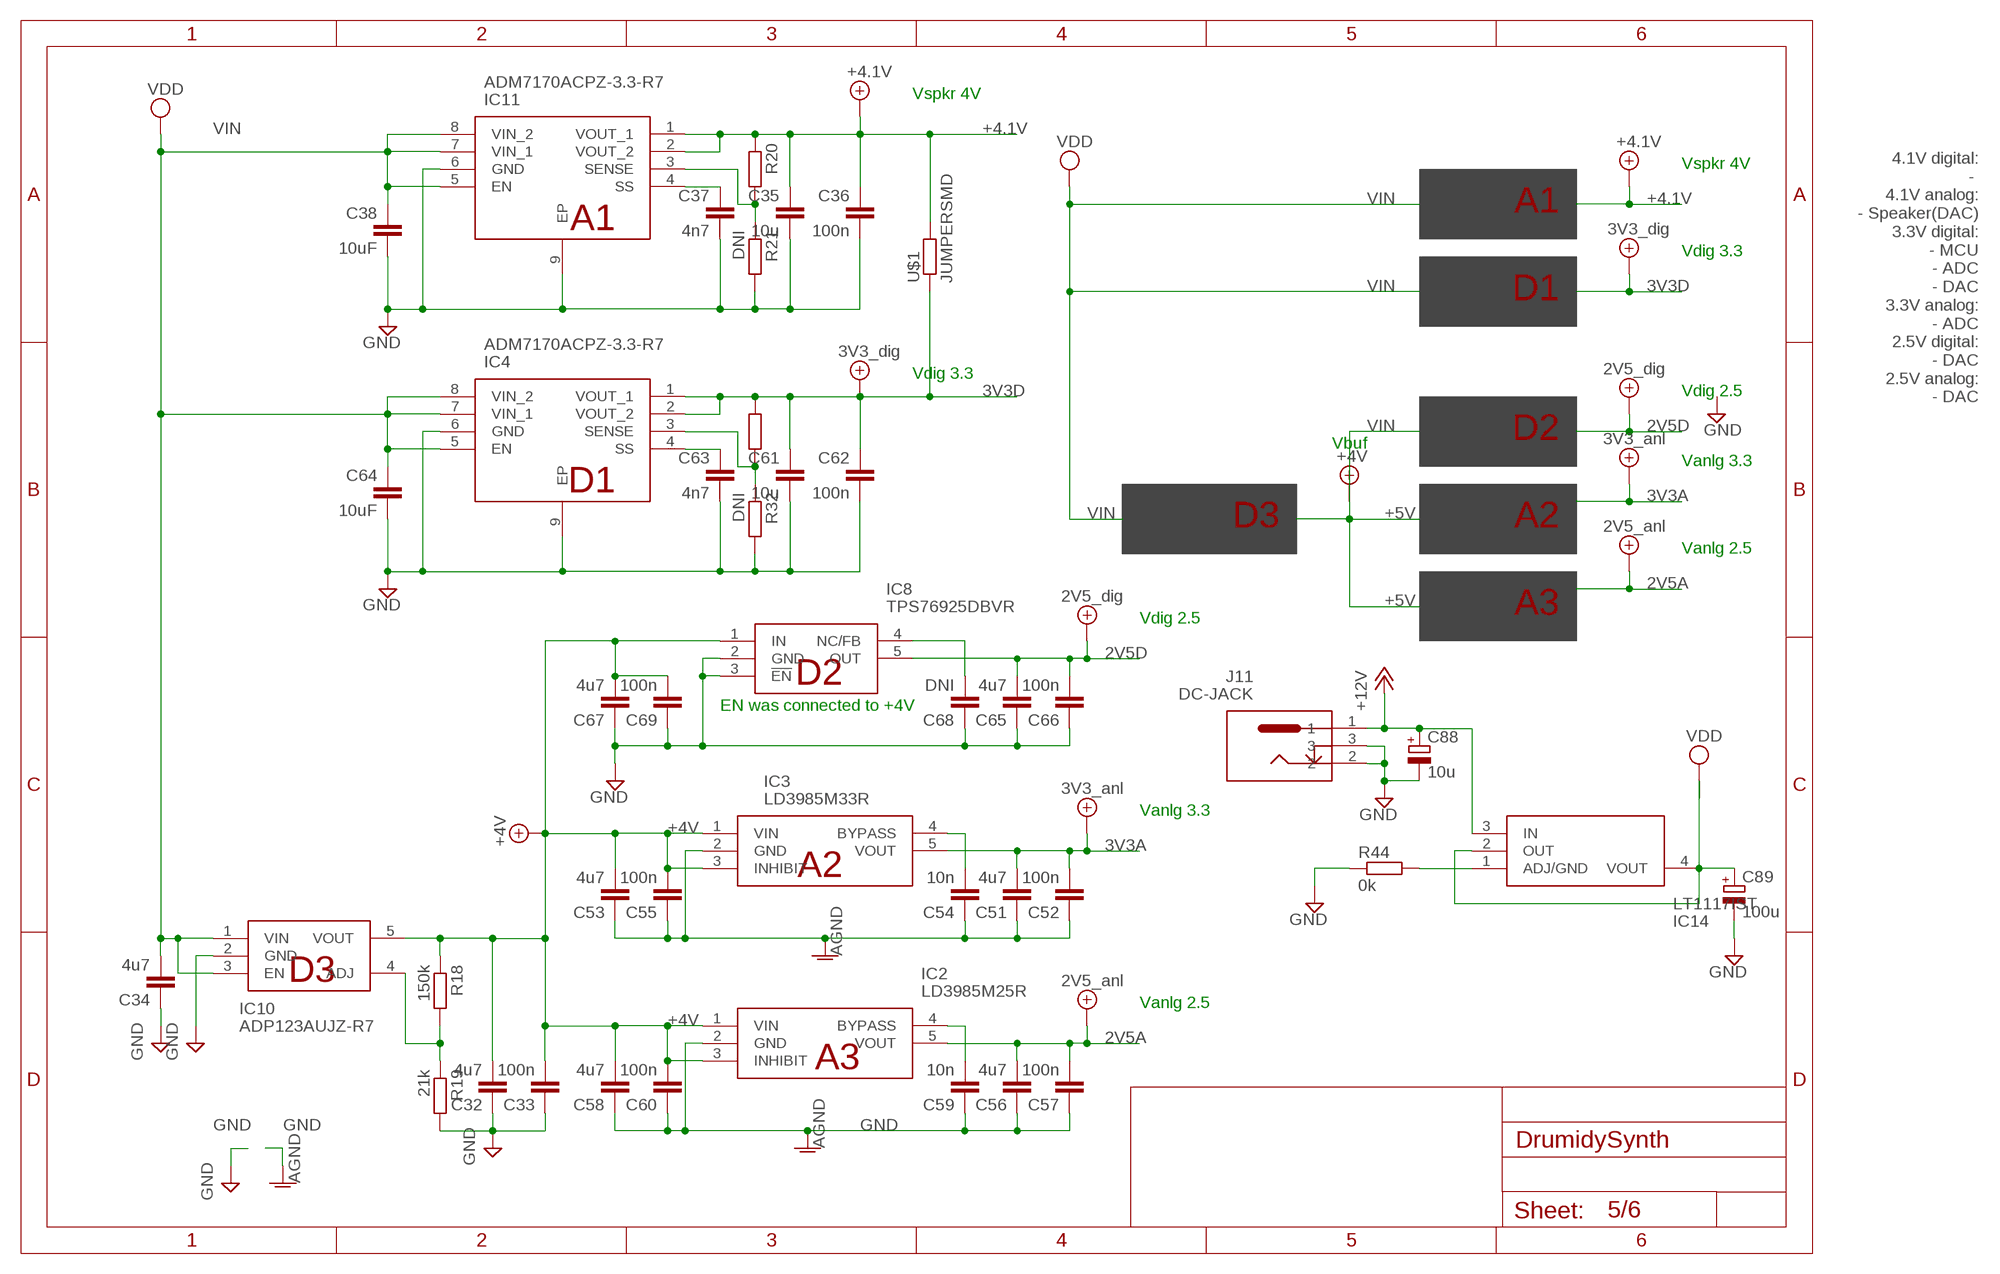
[diagram p4: schematic, sheet 5]

### Parts
C32  4u7  C-EUC0603K  [C0603K]
C33  100n  C-EUC0402  [C0402]
C34  4u7  C-EUC0603K  [C0603K]
C35  10u  C-EUC0603  [C0603]
C36  100n  C-EUC0402K  [C0402K]
C37  4n7  C-EUC0402K  [C0402K]
C38  10uF  C-EUC0603  [C0603]
C51  4u7  C-EUC0603K  [C0603K]
C52  100n  C-EUC0402  [C0402]
C53  4u7  C-EUC0603K  [C0603K]
C54  10n  C-EUC0402K  [C0402K]
C55  100n  C-EUC0402  [C0402]
C56  4u7  C-EUC0603K  [C0603K]
C57  100n  C-EUC0402  [C0402]
C58  4u7  C-EUC0603K  [C0603K]
C59  10n  C-EUC0402K  [C0402K]
C60  100n  C-EUC0402  [C0402]
C61  10u  C-EUC0603  [C0603]
C62  100n  C-EUC0402K  [C0402K]
C63  4n7  C-EUC0402K  [C0402K]
C64  10uF  C-EUC0603  [C0603]
C65  4u7  C-EUC0603K  [C0603K]
C66  100n  C-EUC0402  [C0402]
C67  4u7  C-EUC0603K  [C0603K]
C68  DNI  C-EUC0402K  [C0402K]
C69  100n  C-EUC0402  [C0402]
C88  10u  CPOL-EUE2.5-6  [E2,5-6]
C89  100u  CPOL-EUE2.5-6  [E2,5-6]
IC2  LD3985M25R  [SOT95P280X145-5N]
IC3  LD3985M33R  [SOT95P280X145-5N]
IC4  ADM7170ACPZ-3.3-R7  [SON50P300X300X80-9N]
IC8  TPS76925DBVR  [SOT95P280X145-5N]
IC10  ADP123AUJZ-R7  [SOT95P280X100-5N]
IC11  ADM7170ACPZ-3.3-R7  [SON50P300X300X80-9N]
IC14  LT1117IST  [SOT230P700X180-4N]
J11  DC-JACK  [PRT00119]
R18  150k  R-EU_R0603  [R0603]
R19  21k  R-EU_R0603  [R0603]
R20  0k  R-EU_R0603  [R0603]
R21  DNI  R-EU_R0603  [R0603]
R22  0k  R-EU_R0603  [R0603]
R32  DNI  R-EU_R0603  [R0603]
R44  0k  R-EU_R0603  [R0603]
U$1  JUMPERSMD  [JUMPERWIDE]

### Nets
2V5A: C56.2 C57.2 IC2.5(VOUT) ; supply symbol labelled 2V5_anl ; also sheet 3
2V5D: C65.2 C66.2 IC8.5(OUT) ; supply symbol labelled 2V5_dig ; also sheet 3
3V3A: C51.2 C52.2 IC3.5(VOUT) ; supply symbol labelled 3V3_anl ; also sheet 4
3V3D: C61.1 C62.1 IC4.1(VOUT_1) IC4.2(VOUT_2) R22.1 U$1.P$1 ; supply symbol labelled 3V3_dig ; also sheet 1,2,3,4,6
+4.1V: C35.1 C36.1 IC11.1(VOUT_1) IC11.2(VOUT_2) R20.1 U$1.P$2 ; also sheet 3
+4V: C32.2 C33.2 C53.2 C55.2 C58.2 C60.2 C67.2 C69.2 IC2.1(VIN) IC2.3(INHIBIT) IC3.1(VIN) IC3.3(INHIBIT) IC8.1(IN) IC10.5(VOUT) R18.1
+12V: C88.+ IC14.3(IN) J11.1
GND: C32.1 C33.1 C34.1 C35.2 C36.2 C37.2 C38.2 C51.1 C52.1 C53.1 C54.1 C55.1 C56.1 C57.1 C58.1 C59.1 C60.1 C61.2 C62.2 C63.2 C64.2 C65.1 C66.1 C67.1 C68.1 C69.1 C88.- C89.- IC2.2(GND) IC3.2(GND) IC4.6(GND) IC4.9(EP) IC8.2(GND) IC8.3(!EN) IC10.2(GND) IC11.6(GND) IC11.9(EP) J11.2 J11.3 R19.2 R21.2 R32.2 R44.1 ; supply symbol labelled AGND ; also sheet 1,2,3,4,6
N$51: IC10.4(ADJ) R18.2 R19.1
N$53: IC11.3(SENSE) R20.2 R21.1
N$54: C63.1 IC4.4(SS)
N$56: IC4.3(SENSE) R22.2 R32.1
N$57: C54.2 IC3.4(BYPASS)
N$58: C68.2 IC8.4(NC/FB)
N$60: C59.2 IC2.4(BYPASS)
N$89: IC14.1(ADJ/GND) R44.2
N$126: C37.1 IC11.4(SS)
VIN: C34.2 C38.1 C64.1 C89.+ IC4.5(EN) IC4.7(VIN_1) IC4.8(VIN_2) IC10.1(VIN) IC10.3(EN) IC11.5(EN) IC11.7(VIN_1) IC11.8(VIN_2) IC14.2(OUT) IC14.4(VOUT) ; supply symbol labelled VDD ; also sheet 1,2

### Notes on the sheet
- Vspkr 4V
- 4.1V digital:
  - 
  4.1V analog:
  - Speaker(DAC)
  3.3V digital:
  - MCU
  - ADC
  - DAC
  3.3V analog:
  - ADC
  2.5V digital:
  - DAC
  2.5V analog:
  - DAC
- Vspkr 4V
- A1
- A1
- Vdig 3.3
- D1
- Vdig 3.3
- Vdig 2.5
- D2
- Vbuf
- D1 | Vanlg 3.3
- D3 | A2
- Vanlg 2.5
- A3
- Vdig 2.5
- D2
- EN was connected to +4V
- Vanlg 3.3
- A2
- D3
- Vanlg 2.5
- A3

## Sheet 6 of 6: Audio jacks and filters
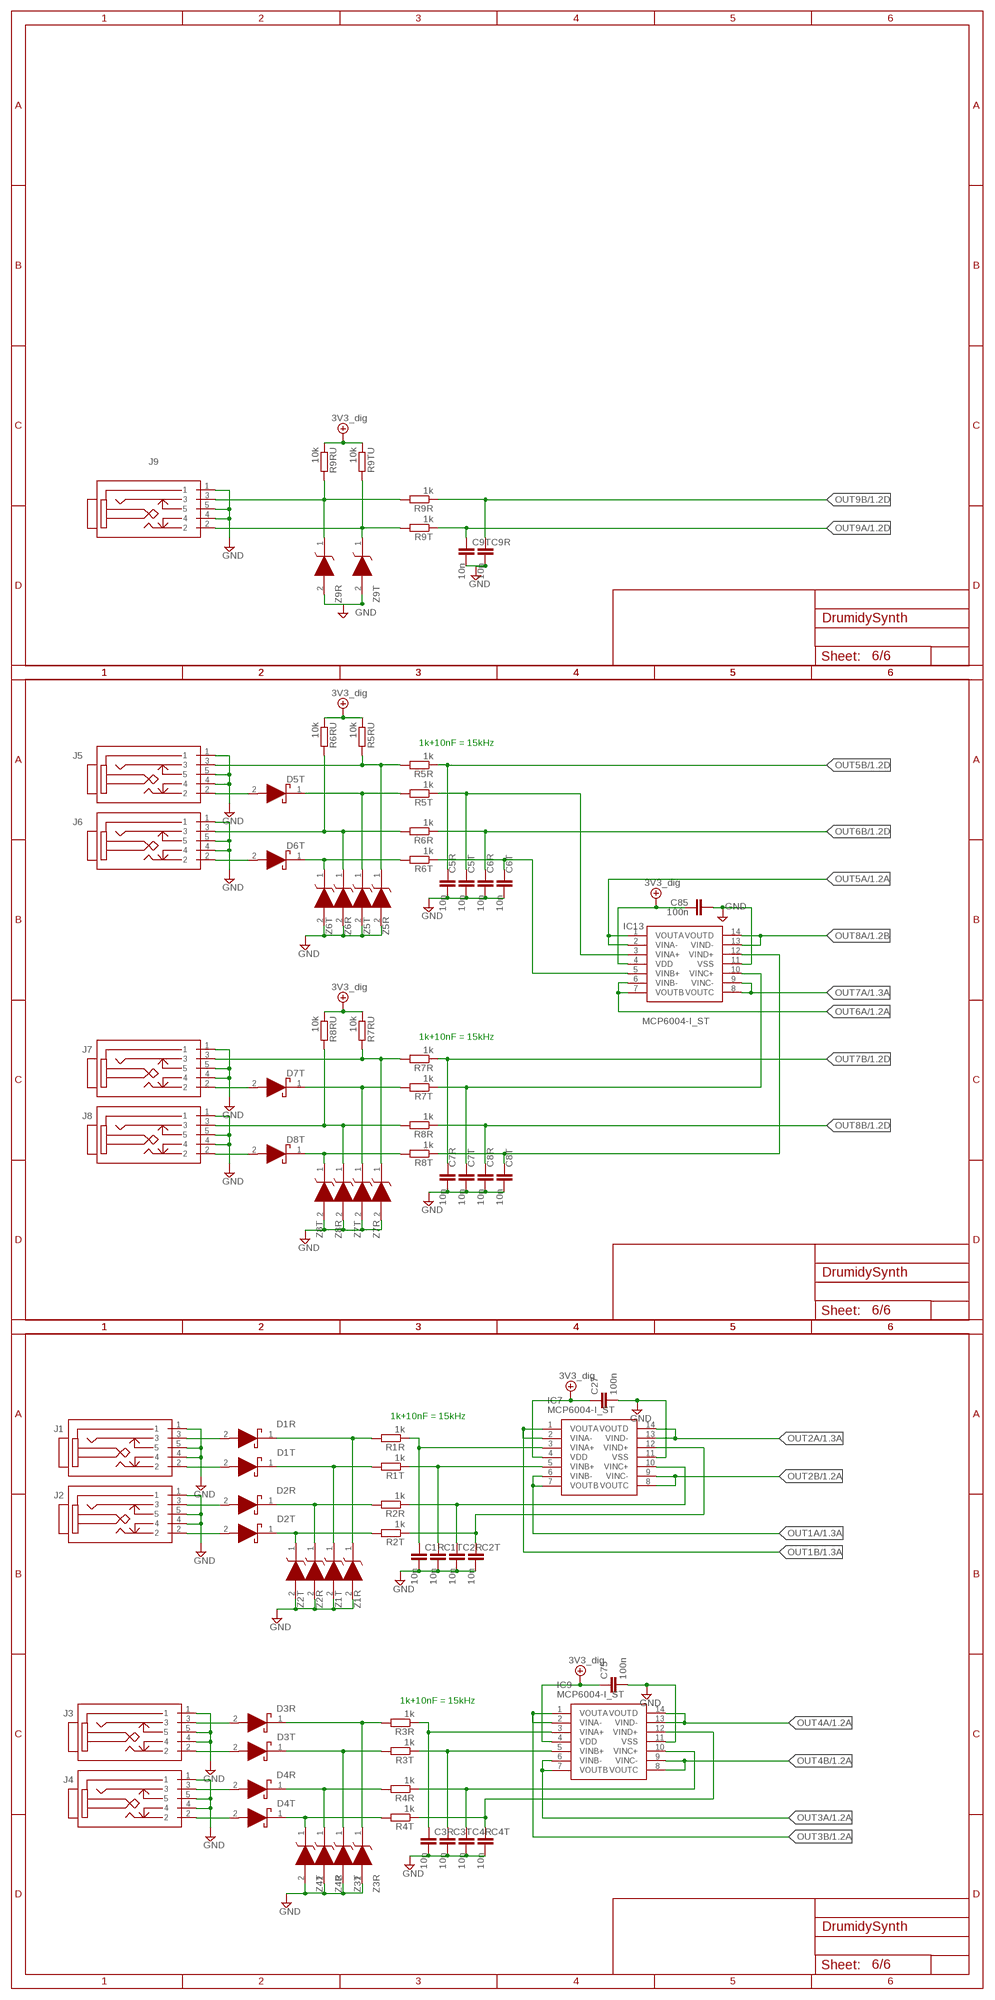
[diagram p5: schematic, sheet 6]

### Parts
C1R  10n  C-EUC0603K  [C0603K]
C1T  10n  C-EUC0603K  [C0603K]
C2R  10n  C-EUC0603K  [C0603K]
C2T  10n  C-EUC0603K  [C0603K]
C3R  10n  C-EUC0603K  [C0603K]
C3T  10n  C-EUC0603K  [C0603K]
C4R  10n  C-EUC0603K  [C0603K]
C4T  10n  C-EUC0603K  [C0603K]
C5R  10n  C-EUC0603K  [C0603K]
C5T  10n  C-EUC0603K  [C0603K]
C6R  10n  C-EUC0603K  [C0603K]
C6T  10n  C-EUC0603K  [C0603K]
C7R  10n  C-EUC0603K  [C0603K]
C7T  10n  C-EUC0603K  [C0603K]
C8R  10n  C-EUC0603K  [C0603K]
C8T  10n  C-EUC0603K  [C0603K]
C9R  10n  C-EUC0603K  [C0603K]
C9T  10n  C-EUC0603K  [C0603K]
C27  100n  C-EUC0805  [C0805]
C75  100n  C-EUC0805  [C0805]
C85  100n  C-EUC0805  [C0805]
D1R  BAT54J,115  [SODFL2512X80N]
D1T  BAT54J,115  [SODFL2512X80N]
D2R  BAT54J,115  [SODFL2512X80N]
D2T  BAT54J,115  [SODFL2512X80N]
D3R  BAT54J,115  [SODFL2512X80N]
D3T  BAT54J,115  [SODFL2512X80N]
D4R  BAT54J,115  [SODFL2512X80N]
D4T  BAT54J,115  [SODFL2512X80N]
D5T  BAT54J,115  [SODFL2512X80N]
D6T  BAT54J,115  [SODFL2512X80N]
D7T  BAT54J,115  [SODFL2512X80N]
D8T  BAT54J,115  [SODFL2512X80N]
IC7  MCP6004-I_ST  [SOP65P640X120-14N]
IC9  MCP6004-I_ST  [SOP65P640X120-14N]
IC13  MCP6004-I_ST  [SOP65P640X120-14N]
J1  35RAPC2AVN4  [35RAPC2AVN4]
J2  35RAPC2AVN4  [35RAPC2AVN4]
J3  35RAPC2AVN4  [35RAPC2AVN4]
J4  35RAPC2AVN4  [35RAPC2AVN4]
J5  35RAPC2AVN4  [35RAPC2AVN4]
J6  35RAPC2AVN4  [35RAPC2AVN4]
J7  35RAPC2AVN4  [35RAPC2AVN4]
J8  35RAPC2AVN4  [35RAPC2AVN4]
J9  35RAPC2AVN4  [35RAPC2AVN4]
R1R  1k  R-EU_R0603  [R0603]
R1T  1k  R-EU_R0603  [R0603]
R2R  1k  R-EU_R0603  [R0603]
R2T  1k  R-EU_R0603  [R0603]
R3R  1k  R-EU_R0603  [R0603]
R3T  1k  R-EU_R0603  [R0603]
R4R  1k  R-EU_R0603  [R0603]
R4T  1k  R-EU_R0603  [R0603]
R5R  1k  R-EU_R0603  [R0603]
R5RU  10k  R-EU_R0603  [R0603]
R5T  1k  R-EU_R0603  [R0603]
R6R  1k  R-EU_R0603  [R0603]
R6RU  10k  R-EU_R0603  [R0603]
R6T  1k  R-EU_R0603  [R0603]
R7R  1k  R-EU_R0603  [R0603]
R7RU  10k  R-EU_R0603  [R0603]
R7T  1k  R-EU_R0603  [R0603]
R8R  1k  R-EU_R0603  [R0603]
R8RU  10k  R-EU_R0603  [R0603]
R8T  1k  R-EU_R0603  [R0603]
R9R  1k  R-EU_R0603  [R0603]
R9RU  10k  R-EU_R0603  [R0603]
R9T  1k  R-EU_R0603  [R0603]
R9TU  10k  R-EU_R0603  [R0603]
Z1R  MM3Z3V3T1G  [SOD2512X110N]
Z1T  MM3Z3V3T1G  [SOD2512X110N]
Z2R  MM3Z3V3T1G  [SOD2512X110N]
Z2T  MM3Z3V3T1G  [SOD2512X110N]
Z3R  MM3Z3V3T1G  [SOD2512X110N]
Z3T  MM3Z3V3T1G  [SOD2512X110N]
Z4R  MM3Z3V3T1G  [SOD2512X110N]
Z4T  MM3Z3V3T1G  [SOD2512X110N]
Z5R  MM3Z3V3T1G  [SOD2512X110N]
Z5T  MM3Z3V3T1G  [SOD2512X110N]
Z6R  MM3Z3V3T1G  [SOD2512X110N]
Z6T  MM3Z3V3T1G  [SOD2512X110N]
Z7R  MM3Z3V3T1G  [SOD2512X110N]
Z7T  MM3Z3V3T1G  [SOD2512X110N]
Z8R  MM3Z3V3T1G  [SOD2512X110N]
Z8T  MM3Z3V3T1G  [SOD2512X110N]
Z9R  MM3Z3V3T1G  [SOD2512X110N]
Z9T  MM3Z3V3T1G  [SOD2512X110N]

### Nets
3V3D: C27.1 C75.1 C85.1 IC7.4(VDD) IC9.4(VDD) IC13.4(VDD) R5RU.1 R6RU.1 R7RU.1 R8RU.1 R9RU.1 R9TU.1 ; supply symbol labelled 3V3_dig ; also sheet 1,2,3,4,5
GND: C1R.2 C1T.2 C2R.2 C2T.2 C3R.2 C3T.2 C4R.2 C4T.2 C5R.2 C5T.2 C6R.2 C6T.2 C7R.2 C7T.2 C8R.2 C8T.2 C9R.2 C9T.2 C27.2 C75.2 C85.2 IC7.11(VSS) IC9.11(VSS) IC13.11(VSS) J1.1 J1.4 J1.5 J2.1 J2.4 J2.5 J3.1 J3.4 J3.5 J4.1 J4.4 J4.5 J5.1 J5.4 J5.5 J6.1 J6.4 J6.5 J7.1 J7.4 J7.5 J8.1 J8.4 J8.5 J9.1 J9.4 J9.5 Z1R.2(A) Z1T.2(A) Z2R.2(A) Z2T.2(A) Z3R.2(A) Z3T.2(A) Z4R.2(A) Z4T.2(A) Z5R.2(A) Z5T.2(A) Z6R.2(A) Z6T.2(A) Z7R.2(A) Z7T.2(A) Z8R.2(A) Z8T.2(A) Z9R.2(A) Z9T.2(A) ; also sheet 1,2,3,4,5
IN0A: C1R.1 IC7.3(VINA+) R1R.1
IN0A2: C3R.1 IC9.3(VINA+) R3R.1
IN0B: C1T.1 IC7.5(VINB+) R1T.1
IN0B1: C7T.1 IC13.10(VINC+) R7T.1
IN0B2: C3T.1 IC9.5(VINB+) R3T.1
IN0B4: C5T.1 IC13.3(VINA+) R5T.1
IN1A: C2R.1 IC7.10(VINC+) R2R.1
IN1A2: C4R.1 IC9.10(VINC+) R4R.1
IN1B: C2T.1 IC7.12(VIND+) R2T.1
IN1B1: C8T.1 IC13.12(VIND+) R8T.1
IN1B2: C4T.1 IC9.12(VIND+) R4T.1
N$19: J7.3 R7R.2 R7RU.2 Z7R.1(K)
N$20: D7T.2(A) J7.2
N$29: J8.3 R8R.2 R8RU.2 Z8R.1(K)
N$30: D8T.2(A) J8.2
N$31: D1R.2(A) J1.3
N$32: D1T.2(A) J1.2
N$33: D2R.2(A) J2.3
N$34: D2T.2(A) J2.2
N$35: D1R.1(K) R1R.2 Z1R.1(K)
N$36: D1T.1(K) R1T.2 Z1T.1(K)
N$37: D2R.1(K) R2R.2 Z2R.1(K)
N$38: D2T.1(K) R2T.2 Z2T.1(K)
N$55: D7T.1(K) R7T.2 Z7T.1(K)
N$61: D8T.1(K) R8T.2 Z8T.1(K)
N$62: D3R.2(A) J3.3
N$63: D3T.2(A) J3.2
N$64: D4R.2(A) J4.3
N$65: D4T.2(A) J4.2
N$66: D3R.1(K) R3R.2 Z3R.1(K)
N$67: D3T.1(K) R3T.2 Z3T.1(K)
N$68: D4R.1(K) R4R.2 Z4R.1(K)
N$69: D4T.1(K) R4T.2 Z4T.1(K)
N$70: J9.3 R9R.2 R9RU.2 Z9R.1(K)
N$71: C6T.1 IC13.5(VINB+) R6T.1
N$72: J9.2 R9T.2 R9TU.2 Z9T.1(K)
N$78: J5.3 R5R.2 R5RU.2 Z5R.1(K)
N$79: D5T.2(A) J5.2
N$80: J6.3 R6R.2 R6RU.2 Z6R.1(K)
N$81: D6T.2(A) J6.2
N$83: D5T.1(K) R5T.2 Z5T.1(K)
N$85: D6T.1(K) R6T.2 Z6T.1(K)
OUT1A: IC7.6(VINB-) IC7.7(VOUTB) ; also sheet 1
OUT1B: IC7.1(VOUTA) IC7.2(VINA-) ; also sheet 1
OUT2A: IC7.13(VIND-) IC7.14(VOUTD) ; also sheet 1
OUT2B: IC7.8(VOUTC) IC7.9(VINC-) ; also sheet 1
OUT3A: IC9.6(VINB-) IC9.7(VOUTB) ; also sheet 1
OUT3B: IC9.1(VOUTA) IC9.2(VINA-) ; also sheet 1
OUT4A: IC9.13(VIND-) IC9.14(VOUTD) ; also sheet 1
OUT4B: IC9.8(VOUTC) IC9.9(VINC-) ; also sheet 1
OUT5A: IC13.1(VOUTA) IC13.2(VINA-) ; also sheet 1
OUT5B: C5R.1 R5R.1 ; also sheet 1
OUT6A: IC13.6(VINB-) IC13.7(VOUTB) ; also sheet 1
OUT6B: C6R.1 R6R.1 ; also sheet 1
OUT7A: IC13.8(VOUTC) IC13.9(VINC-) ; also sheet 1
OUT7B: C7R.1 R7R.1 ; also sheet 1
OUT8A: IC13.13(VIND-) IC13.14(VOUTD) ; also sheet 1
OUT8B: C8R.1 R8R.1 ; also sheet 1
OUT9A: C9T.1 R9T.1 ; also sheet 1
OUT9B: C9R.1 R9R.1 ; also sheet 1

### Notes on the sheet
- 1k+10nF = 15kHz
- 1k+10nF = 15kHz
- 1k+10nF = 15kHz
- 1k+10nF = 15kHz

## Library data of the parts
BTN1-BTN9 = evg-Digital:31-XX: OMRON SWITCH; MPN: B3F-3100; OC_FARNELL: 959704; OC_NEWARK: 36M3582
C1 C1R C1T C2 C2R C2T C3 C3R C3T C4 C4R C4T C5 C5R C5T C6 C6R C6T C7 C7R C7T C8 C8R C8T C9 C9R C9T C10-C46 C49-C87 C90-C108 = rcl:C-EU: CAPACITOR, European symbol; SPICEPREFIX: C
C47 C48 C88 C89 = rcl:CPOL-EU: POLARIZED CAPACITOR, European symbol; SPICEPREFIX: C
D1R D1R1 D1T D2R D2T D3R D3T D4R D4T D5T D6T D7T D8T = evg-Analog:BAT54J,115: Schottky barrier diode 30V 200mA SOD323F Source: Datasheet <http://uk.rs-online.com/web/p/products/7805363P>; DESCRIPTION: Schottky barrier diode 30V 200mA SOD323F; HEIGHT: 0.8mm; MANUFACTURER_NAME: Nexperia; MANUFACTURER_PART_NUMBER: BAT54J,115; RS_PART_NUMBER: 7805363P; RS_PRICE-STOCK: http://uk.rs-online.com/web/p/products/7805363P
IC1 = evg-ADC-DAC-Digipots:CS43L22-CNZR: Audio D/A Converter ICs IC Low PWR DAC w/ClassD Spkr Driver Source: Datasheet <https://d3uzseaevmutz1.cloudfront.net/pubs/proDatasheet/CS43L22_F2.pdf>; DESCRIPTION: Audio D/A Converter ICs IC Low PWR DAC w/ClassD Spkr Driver; HEIGHT: 1mm; MANUFACTURER_NAME: Cirrus Logic; MANUFACTURER_PART_NUMBER: CS43L22-CNZR
IC2 = evg-LDO-DCDC:LD3985M25R: LD3985M25R, Low Dropout Voltage Regulator, 0.55A, 2.5V +/-2%, 2.5 to 6Vin, 5-Pin SOT-23 Source: Datasheet <http://uk.rs-online.com/web/p/products/6868809P>; ALLIED_NUMBER: 70390243; DESCRIPTION: LD3985M25R, Low Dropout Voltage Regulator, 0.55A, 2.5V +/-2%, 2.5 to 6Vin, 5-Pin SOT-23; HEIGHT: 1.45mm; MANUFACTURER_NAME: STMicroelectronics; MANUFACTURER_PART_NUMBER: LD3985M25R; RS_PART_NUMBER: 6868809P; RS_PRICE-STOCK: http://uk.rs-online.com/web/p/products/6868809P
IC3 = evg-LDO-DCDC:LD3985M33R: LD3985M33R, Low Dropout Voltage Regulator, 0.55A, 3.3V +/-2%, 2.5 to 6Vin, 5-Pin SOT-23 Source: Datasheet <http://uk.rs-online.com/web/p/products/6868802P>; ALLIED_NUMBER: 70390246; DESCRIPTION: LD3985M33R, Low Dropout Voltage Regulator, 0.55A, 3.3V +/-2%, 2.5 to 6Vin, 5-Pin SOT-23; HEIGHT: 1.45mm; MANUFACTURER_NAME: STMicroelectronics; MANUFACTURER_PART_NUMBER: LD3985M33R; RS_PART_NUMBER: 6868802P; RS_PRICE-STOCK: http://uk.rs-online.com/web/p/products/6868802P
IC4 IC11 = evg-LDO-DCDC:ADM7170ACPZ-3.3-R7: ANALOG DEVICES - ADM7170ACPZ-3.3-R7 - LDO, FIXED, 3.3V, 0.5A, LFCSP-8 Source: Datasheet <http://www.analog.com/media/en/technical-documentation/data-sheets/ADM7170.pdf>; ARROW_PART_NUMBER: ADM7170ACPZ-3.3-R7; ARROW_PRICE-STOCK: https://www.arrow.com/en/products/adm7170acpz-3.3-r7/analog-devices; DESCRIPTION: ANALOG DEVICES - ADM7170ACPZ-3.3-R7 - LDO, FIXED, 3.3V, 0.5A, LFCSP-8; HEIGHT: 0.8mm; MANUFACTURER_NAME: Analog Devices; MANUFACTURER_PART_NUMBER: ADM7170ACPZ-3.3-R7; MOUSER_PART_NUMBER: 584-ADM7170ACPZ3.3R7; MOUSER_PRICE-STOCK: https://www.mouser.co.uk/ProductDetail/Analog-Devices/ADM7170ACPZ-33-R7?qs=iCT64eccu7inD4cn9w5Bog%3D%3D
IC5 = evg-ADC-DAC-Digipots:WM8782SEDS_RV: Audio A/D Converter ICs Stereo ADC Source: Datasheet <https://datasheet.datasheetarchive.com/originals/distributors/DKDS-25/482478.pdf>; DESCRIPTION: Audio A/D Converter ICs Stereo ADC; HEIGHT: 2mm; MANUFACTURER_NAME: Cirrus Logic; MANUFACTURER_PART_NUMBER: WM8782SEDS/RV; MOUSER_PART_NUMBER: 238-WM8782SEDS/RV; MOUSER_PRICE-STOCK: https://www.mouser.co.uk/ProductDetail/Cirrus-Logic/WM8782SEDS-RV?qs=AjlVVxtvkmS%2FRIyWIOkwKg%3D%3D
IC6 = evg-Microcontrollers:STM32F103C8T6TR: ARM Microcontrollers - MCU 32BIT Cortex M3 USB 7 TIMERS 2 ADCS CAN Source: Datasheet <http://media.digikey.com/pdf/Data Sheets/ST Microelectronics PDFS/STM32F103x8,B.pdf>; DESCRIPTION: ARM Microcontrollers - MCU 32BIT Cortex M3 USB 7 TIMERS 2 ADCS CAN; HEIGHT: 1.6mm; MANUFACTURER_NAME: STMicroelectronics; MANUFACTURER_PART_NUMBER: STM32F103C8T6TR
IC7 IC9 IC13 = evg-OpAmps-Comparators:MCP6004-I_ST: Quad 1.8V 1MHz OpAmp,MCP6004-I/ST Source: Datasheet <http://ww1.microchip.com/downloads/en/DeviceDoc/21733j.pdf>; ARROW_PART_NUMBER: MCP6004-I/ST; ARROW_PRICE-STOCK: https://www.arrow.com/en/products/mcp6004-ist/microchip-technology?region=nac; DESCRIPTION: Quad 1.8V 1MHz OpAmp,MCP6004-I/ST; HEIGHT: 1.2mm; MANUFACTURER_NAME: Microchip; MANUFACTURER_PART_NUMBER: MCP6004-I/ST; MOUSER_PART_NUMBER: 579-MCP6004-I/ST; MOUSER_PRICE-STOCK: https://www.mouser.co.uk/ProductDetail/Microchip-Technology/MCP6004-I-ST?qs=QQ%252Byn%2FmNCzxDr1apSSrjLw%3D%3D
IC8 = evg-LDO-DCDC:TPS76925DBVR: 10-V, 100-mA, Low Iq, Low-Dropout Linear Regulator Source: Datasheet <http://www.ti.com/lit/gpn/tps769>; DESCRIPTION: 10-V, 100-mA, Low Iq, Low-Dropout Linear Regulator; HEIGHT: 1.45mm; MANUFACTURER_NAME: Texas Instruments; MANUFACTURER_PART_NUMBER: TPS76925DBVR
IC10 = evg-LDO-DCDC:ADP123AUJZ-R7: Linear Voltage Regulators 5.5V Input 300mA Low Quiescent Crnt CMOS Source: Datasheet <https://www.analog.com/media/en/technical-documentation/data-sheets/ADP122_123.pdf>; DESCRIPTION: Linear Voltage Regulators 5.5V Input 300mA Low Quiescent Crnt CMOS; HEIGHT: 1mm; MANUFACTURER_NAME: Linear Technology; MANUFACTURER_PART_NUMBER: ADP123AUJZ-R7; MOUSER_PART_NUMBER: 584-ADP123AUJZ-R7; MOUSER_PRICE-STOCK: https://www.mouser.com/Search/Refine.aspx?Keyword=584-ADP123AUJZ-R7
IC12 = evg-Microcontrollers:W25Q512JVEIQ: NOR Flash Source: Datasheet <https://www.arrow.com/en/products/w25q512jveiq/winbond-electronics>; DESCRIPTION: NOR Flash; HEIGHT: 0.8mm; MANUFACTURER_NAME: Winbond; MANUFACTURER_PART_NUMBER: W25Q512JVEIQ; MOUSER_PART_NUMBER: 454-W25Q512JVEIQ; MOUSER_PRICE-STOCK: https://www.mouser.co.uk/ProductDetail/Winbond/W25Q512JVEIQ?qs=l7cgNqFNU1jw6svr3at6tA%3D%3D
IC14 = evg-LDO-DCDC:LT1117IST: Linear Technology LT1117IST-5#PBF, LDO Regulator, 800mA, 5 V, +/-1% 3+Tab-Pin, SOT-223 Source: Datasheet <http://uk.rs-online.com/web/p/products/8846936P>; DESCRIPTION: Linear Technology LT1117IST-5#PBF, LDO Regulator, 800mA, 5 V, +/-1% 3+Tab-Pin, SOT-223; HEIGHT: 1.8mm; MANUFACTURER_NAME: Linear Technology; MANUFACTURER_PART_NUMBER: LT1117IST-5#PBF; RS_PART_NUMBER: 8846936P; RS_PRICE-STOCK: http://uk.rs-online.com/web/p/products/8846936P
J1-J9 JHP = evg-Connectors:35RAPC2AVN4: Conn 3.5MM Mono Jack F 3 POS Solder RA Thru-Hole 3 Terminal 1 Port Source: Datasheet <https://componentsearchengine.com/Datasheets/1/35RAPC2AVN4.pdf>; ALLIED_NUMBER: 70930046; DESCRIPTION: Conn 3.5MM Mono Jack F 3 POS Solder RA Thru-Hole 3 Terminal 1 Port; HEIGHT: 12.3mm; MANUFACTURER_NAME: Switchcraft; MANUFACTURER_PART_NUMBER: 35RAPC2AVN4
J10 USBHA = evg-Connectors:10103594-0001LF: USB - micro B USB 2.0 Receptacle Connector 5 Position Surface Mount, Right Angle; Through Hole; DESCRIPTION: USB - micro B USB 2.0 Receptacle Connector 5 Position Surface Mount, Right Angle; Through Hole; DIGI-KEY_PART_NUMBER: 609-4050-1-ND; MF: Amphenol ICC; MP: 10103594-0001LF; PACKAGE: None; PURCHASE-URL: https://pricing.snapeda.com/search/part/10103594-0001LF/?ref=eda
J11 = evg-Connectors:DC-JACK: SparkFun Accessories DC Barrel Power Jack/Connector Source: Datasheet <https://www.sparkfun.com/datasheets/Prototyping/Barrel-Connector-PJ-202A.pdf>; DESCRIPTION: SparkFun Accessories DC Barrel Power Jack/Connector; HEIGHT: 11mm; MANUFACTURER_NAME: SparkFun; MANUFACTURER_PART_NUMBER: PRT-00119
J12 = evg-Digital:GSD090012SEU: Memory Card Connectors SD CARD CONNECTOR 9 POS, SMT Source: Datasheet <http://uk.rs-online.com/web/p/products/2208512>; DESCRIPTION: Memory Card Connectors SD CARD CONNECTOR 9 POS, SMT; HEIGHT: 3.15mm; MANUFACTURER_NAME: Amphenol; MANUFACTURER_PART_NUMBER: GSD090012SEU; RS_PART_NUMBER: 2208512; RS_PRICE-STOCK: http://uk.rs-online.com/web/p/products/2208512
J13 J14 = evg-Connectors:FTSH-105-01-F-DV-K-A-P-TR: 10 Position, High Reliability Header Strips, 0.050" pitch Source: Datasheet <http://suddendocs.samtec.com/prints/ftsh-1xx-xx-xxx-dv-xxx-xxx-mkt.pdf>; ARROW_PART_NUMBER: FTSH-105-01-F-DV-K-A-P-TR; ARROW_PRICE-STOCK: https://www.arrow.com/en/products/ftsh-105-01-f-dv-k-a-p-tr/samtec?region=nac; DESCRIPTION: 10 Position, High Reliability Header Strips, 0.050&quot; pitch; HEIGHT: mm; MANUFACTURER_NAME: SAMTEC; MANUFACTURER_PART_NUMBER: FTSH-105-01-F-DV-K-A-P-TR; MOUSER_PART_NUMBER: 200-FTSH1051FDVKAPTR; MOUSER_PRICE-STOCK: https://www.mouser.co.uk/ProductDetail/Samtec/FTSH-105-01-F-DV-K-A-P-TR?qs=Cqqh%252BS766wltf3gfR2aYRA%3D%3D
JADC JOUT = evg-Connectors:SJ-63073E: Phone Connectors audio jack, 6.35 mm, horizontal, 3 conductor, through hole, 3 switches, w/ nut Source: Datasheet <https://www.cuidevices.com/product/resource/sj-6307.pdf>; DESCRIPTION: Phone Connectors audio jack, 6.35 mm, horizontal, 3 conductor, through hole, 3 switches, w/ nut; HEIGHT: 15.7mm; MANUFACTURER_NAME: CUI Inc.; MANUFACTURER_PART_NUMBER: SJ-63073E; MOUSER_PART_NUMBER: 490-SJ-63073E; MOUSER_PRICE-STOCK: https://www.mouser.co.uk/ProductDetail/CUI-Devices/SJ-63073E?qs=hWgE7mdIu5Tbs4N%252BWNx3vg%3D%3D
JIN1-JIN4 = evg-Connectors:JACK35VERT
L4 R1 R1R R1T R2 R2R R2T R3 R3R R3T R4 R4R R4T R5 R5R R5RU R5T R6 R6R R6RU R6T R7 R7R R7RU R7T R8 R8R R8RU R8T R9 R9R R9RU R9T R9TU R10-R14 R16 R18-R45 R48-R64 RBTN1 RBTN3 RBTN5 RBTN7 RBTN9 RBTN11 RBTN13 RBTN15 RBTN17 RLED1 RLED3 RLED5 RLED7 RLED9 RLED11 RLED13 RLED15 RLED17 = rcl:R-EU_: RESISTOR, European symbol; SPICEPREFIX: R
LED10-LED12 LEDB1 LEDB3 LEDB5 LEDB7 LEDB9 LEDB11 LEDB13 LEDB15 LEDB17 LEDD1 LEDD3 LEDD5 LEDD7 LEDD9 LEDD11 LEDD13 LEDD15 LEDD17 = led:LED: LED OSRAM: - CHIPLED LG R971, LG N971, LY N971, LG Q971, LY Q971, LO R971, LY R971 LH N974, LH R974 LS Q976, LO Q976, LY Q976 LO Q996 - Hyper CHIPLED LW Q18S LB Q993, LB Q99A, LB R99A - SideLED LS A670, LO A670, LY A670, LG A670, LP A670 LB A673, LV A673, LT A673, LW A673 LH A674 LY A675 LS A676, LA A676, LO A676, LY A676, LW A676 LS A679, LY A679, LG A679 - Hyper Micro SIDELED® LS Y876, LA Y876, LO Y876, LY Y876 LT Y87S - SmartLED LW L88C, LW L88S LB L89C, LB L89S, LG L890 LS L89K, LO L89K, LY L89K LS L896, LA L896, LO L896, LY L896 - TOPLED LS T670, LO T670, LY T670, LG T670, LP T670 LSG T670, LSP T670, LSY T670, LOP T670, LYG T670 LG T671, LOG T671, LSG T671 LB T673, LV T673, LT T673, LW T673 LH T674 LS T676, LA T676, LO T676, LY T676, LB T676, LH T676, LSB T676, LW T676 LB T67C, LV T67C, LT T67C, LS T67K, LO T67K, LY T67K, LW E67C LS E67B, LA E67B, LO E67B, LY E67B, LB E67C, LV E67C, LT E67C LW T67C LS T679, LY T679, LG T679 LS T770, LO T770, LY T770, LG T770, LP T770 LB T773, LV T773, LT T773, LW T773 LH T774 LS E675, LA E675, LY E675, LS T675 LS T776, LA T776, LO T776, LY T776, LB T776 LHGB T686 LT T68C, LB T68C - Hyper Mini TOPLED® LB M676 - Mini TOPLED Santana® LG M470 LS M47K, LO M47K, LY M47K Source: http://www.osram.convergy.de LUXEON: - LUMILED® LXK2-PW12-R00, LXK2-PW12-S00, LXK2-PW14-U00, LXK2-PW14-V00 LXK2-PM12-R00, LXK2-PM12-S00, LXK2-PM14-U00 LXK2-PE12-Q00, LXK2-PE12-R00, LXK2-PE12-S00, LXK2-PE14-T00, LXK2-PE14-U00 LXK2-PB12-K00, LXK2-PB12-L00, LXK2-PB12-M00, LXK2-PB14-N00, LXK2-PB14-P00, LXK2-PB14-Q00 LXK2-PR12-L00, LXK2-PR12-M00, LXK2-PR14-Q00, LXK2-PR14-R00 LXK2-PD12-Q00, LXK2-PD12-R00, LXK2-PD12-S00 LXK2-PH12-R00, LXK2-PH12-S00 LXK2-PL12-P00, LXK2-PL12-Q00, LXK2-PL12-R00 Source: www.luxeon.com KINGBRIGHT: KA-3528ASYC Source: www.kingbright.com
LEDA1 LEDA3 LEDA5 LEDA7 LEDA9 LEDA11 LEDA13 LEDA15 LEDA17 LEDC1 LEDC3 LEDC5 LEDC7 LEDC9 LEDC11 LEDC13 LEDC15 LEDC17 = evg-Analog:L-934HD: Red diffused LED,L934HD 25mA 3mm Kingbright L-934HD, Round Series Red LED, 660 nm 3mm (T-1), Round Lens Through Hole package Source: Datasheet <http://uk.rs-online.com/web/p/products/2285922A>; DESCRIPTION: Red diffused LED,L934HD 25mA 3mm Kingbright L-934HD, Round Series Red LED, 660 nm 3mm (T-1), Round Lens Through Hole package; HEIGHT: mm; MANUFACTURER_NAME: Kingbright; MANUFACTURER_PART_NUMBER: L-934HD; RS_PART_NUMBER: 2285922A; RS_PRICE-STOCK: http://uk.rs-online.com/web/p/products/2285922A
Q1 Q2 = crystal:CRYSTAL: CRYSTAL; OC_FARNELL: 1667008; OC_NEWARK: unknown
R15 R17 R46 R47 = evg-Analog:PTV09A-4025U-B103: Potentiometers 10K LINEAR 20% Source: Datasheet <https://www.bourns.com/docs/Product-Datasheets/PTV09.pdf>; DESCRIPTION: Potentiometers 10K LINEAR 20%; HEIGHT: 20mm; MANUFACTURER_NAME: Bourns; MANUFACTURER_PART_NUMBER: PTV09A-4025U-B103
S10 = evg-Digital:STMPS2141STR: Enhanced Power Switch 500mA Low SOT23-5 STMicroelectronics STMPS2141STR Digital Power Switch IC, High Side MOSFET Switch, 0.5A, 2.7 5.5V, 5-Pin Source: Datasheet <http://uk.rs-online.com/web/p/products/8805406P>; DESCRIPTION: Enhanced Power Switch 500mA Low SOT23-5 STMicroelectronics STMPS2141STR Digital Power Switch IC, High Side MOSFET Switch, 0.5A, 2.7 5.5V, 5-Pin; HEIGHT: 1.45mm; MANUFACTURER_NAME: STMicroelectronics; MANUFACTURER_PART_NUMBER: STMPS2141STR; RS_PART_NUMBER: 8805406P; RS_PRICE-STOCK: http://uk.rs-online.com/web/p/products/8805406P
U1 = evg-Microcontrollers:STM32F407VGT6; COPYRIGHT: Copyright (C) 2022 Ultra Librarian. All rights reserved.; MANUFACTURER_PART_NUMBER: STM32F407VGT6; MFR_NAME: STMicroelectronics
U$1 = evg-Analog:JUMPERSMD
U$2 = evg-Digital:TFT-SD
U$3 = evg-Digital:EPAPER2.9
USBHB = evg-Connectors:USB-A(292303-7): Type A USB right angled PCB receptacle Source: Datasheet <http://uk.rs-online.com/web/p/products/9097864>; DESCRIPTION: Type A USB right angled PCB receptacle; HEIGHT: 7.01mm; MANUFACTURER_NAME: TE Connectivity; MANUFACTURER_PART_NUMBER: 292303-7; RS_PART_NUMBER: 9097864; RS_PRICE-STOCK: http://uk.rs-online.com/web/p/products/9097864
VR1 VR2 = evg-Digital:PEC11R-4220F-S0024: Bourns 24 Pulse Incremental Mechanical Rotary Encoder with a 6 mm Flat Shaft (Not Indexed), Through Hole Source: Datasheet <http://uk.rs-online.com/web/p/products/7377767P>; ALLIED_NUMBER: 70276555; DESCRIPTION: Bourns 24 Pulse Incremental Mechanical Rotary Encoder with a 6 mm Flat Shaft (Not Indexed), Through Hole; HEIGHT: 27.5mm; MANUFACTURER_NAME: Bourns; MANUFACTURER_PART_NUMBER: PEC11R-4220F-S0024; RS_PART_NUMBER: 7377767P; RS_PRICE-STOCK: http://uk.rs-online.com/web/p/products/7377767P
X1 X3 = con-samtec:SSW-104-02-G-S: THROUGH-HOLE .025" SQ POST SOCKET Source: Samtec SSW.pdf; MF: Samtec Inc.; MPN: SSW-104-02-G-S; OC_FARNELL: unknown; OC_NEWARK: 11P9384
X2 X5 = con-samtec:SSW-102-02-G-S: THROUGH-HOLE .025" SQ POST SOCKET Source: Samtec SSW.pdf; MF: Samtec Inc.; MPN: SSW-102-02-G-S; OC_FARNELL: unknown; OC_NEWARK: 11P9351
X4 = con-samtec:SSW-104-02-G: THROUGH-HOLE .025" SQ POST SOCKET Source: Samtec SSW.pdf; MF: Samtec Inc.; MPN: SSW-104-02-G-D; OC_FARNELL: 1668346; OC_NEWARK: 11P9382
Z1R Z1T Z2R Z2T Z3R Z3T Z4R Z4T Z5R Z5T Z6R Z6T Z7R Z7T Z8R Z8T Z9R Z9T = evg-Analog:MM3Z3V3T1G: ON Semiconductor MM3Z3V3T1G Zener Diode, 3.3V 5% 200 mW SMT 2-Pin SOD-323 Source: Datasheet <http://uk.rs-online.com/web/p/products/1841319P>; DESCRIPTION: ON Semiconductor MM3Z3V3T1G Zener Diode, 3.3V 5% 200 mW SMT 2-Pin SOD-323; HEIGHT: 1.1mm; MANUFACTURER_NAME: ON Semiconductor; MANUFACTURER_PART_NUMBER: MM3Z3V3T1G; RS_PART_NUMBER: 1841319P; RS_PRICE-STOCK: http://uk.rs-online.com/web/p/products/1841319P